# EAGLE design Payload-Camera (EAGLE 9.5.1)
DESIGNER: Hendrik Melse; PART_NUMBER: 68-0007; PROJECT: CougSat-1: Camera; REV: 1.1.2

## Sheet 1 of 6
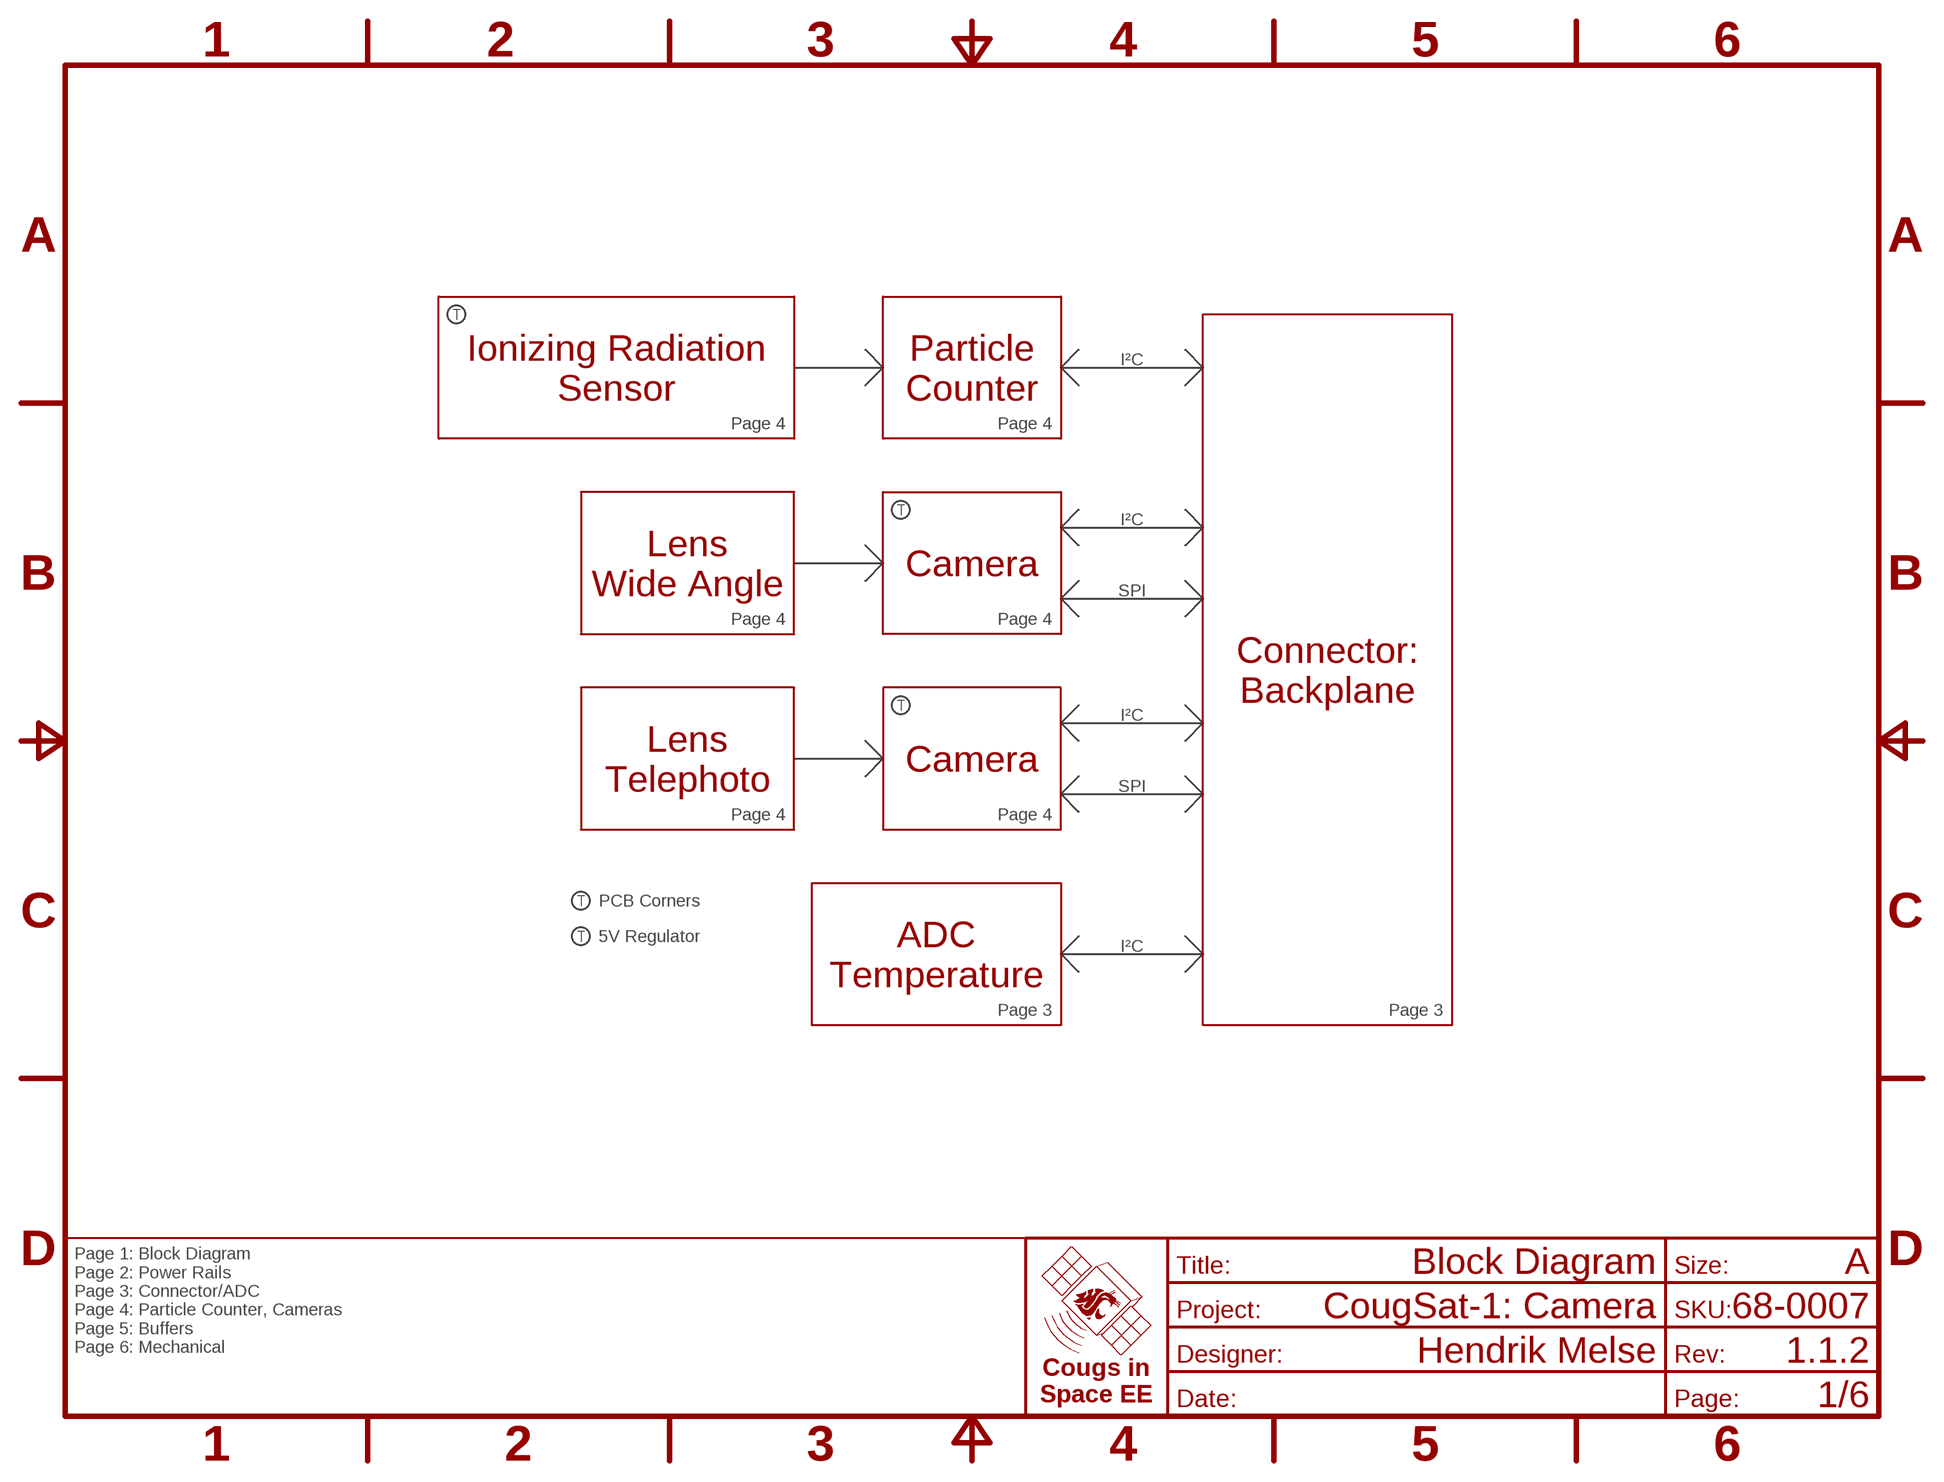
[diagram p0: schematic, sheet 1]
FRAME1 (FRAME-A): TITLE: Block Diagram

### Notes on the sheet
- I²C
- Ionizing Radiation
  Sensor
- Particle
  Counter
- Page 4 | Page 4
- I²C
- Lens
  Wide Angle
- Camera
- SPI
- Page 4 | Page 4
- Connector:
  Backplane
- I²C
- Lens
  Telephoto
- Camera
- SPI
- Page 4 | Page 4
- PCB Corners
- 5V Regulator
- I²C
- ADC
  Temperature
- Page 3 | Page 3
- Page 1: Block Diagram
  Page 2: Power Rails
  Page 3: Connector/ADC
  Page 4: Particle Counter, Cameras
  Page 5: Buffers
  Page 6: Mechanical

## Sheet 2 of 6
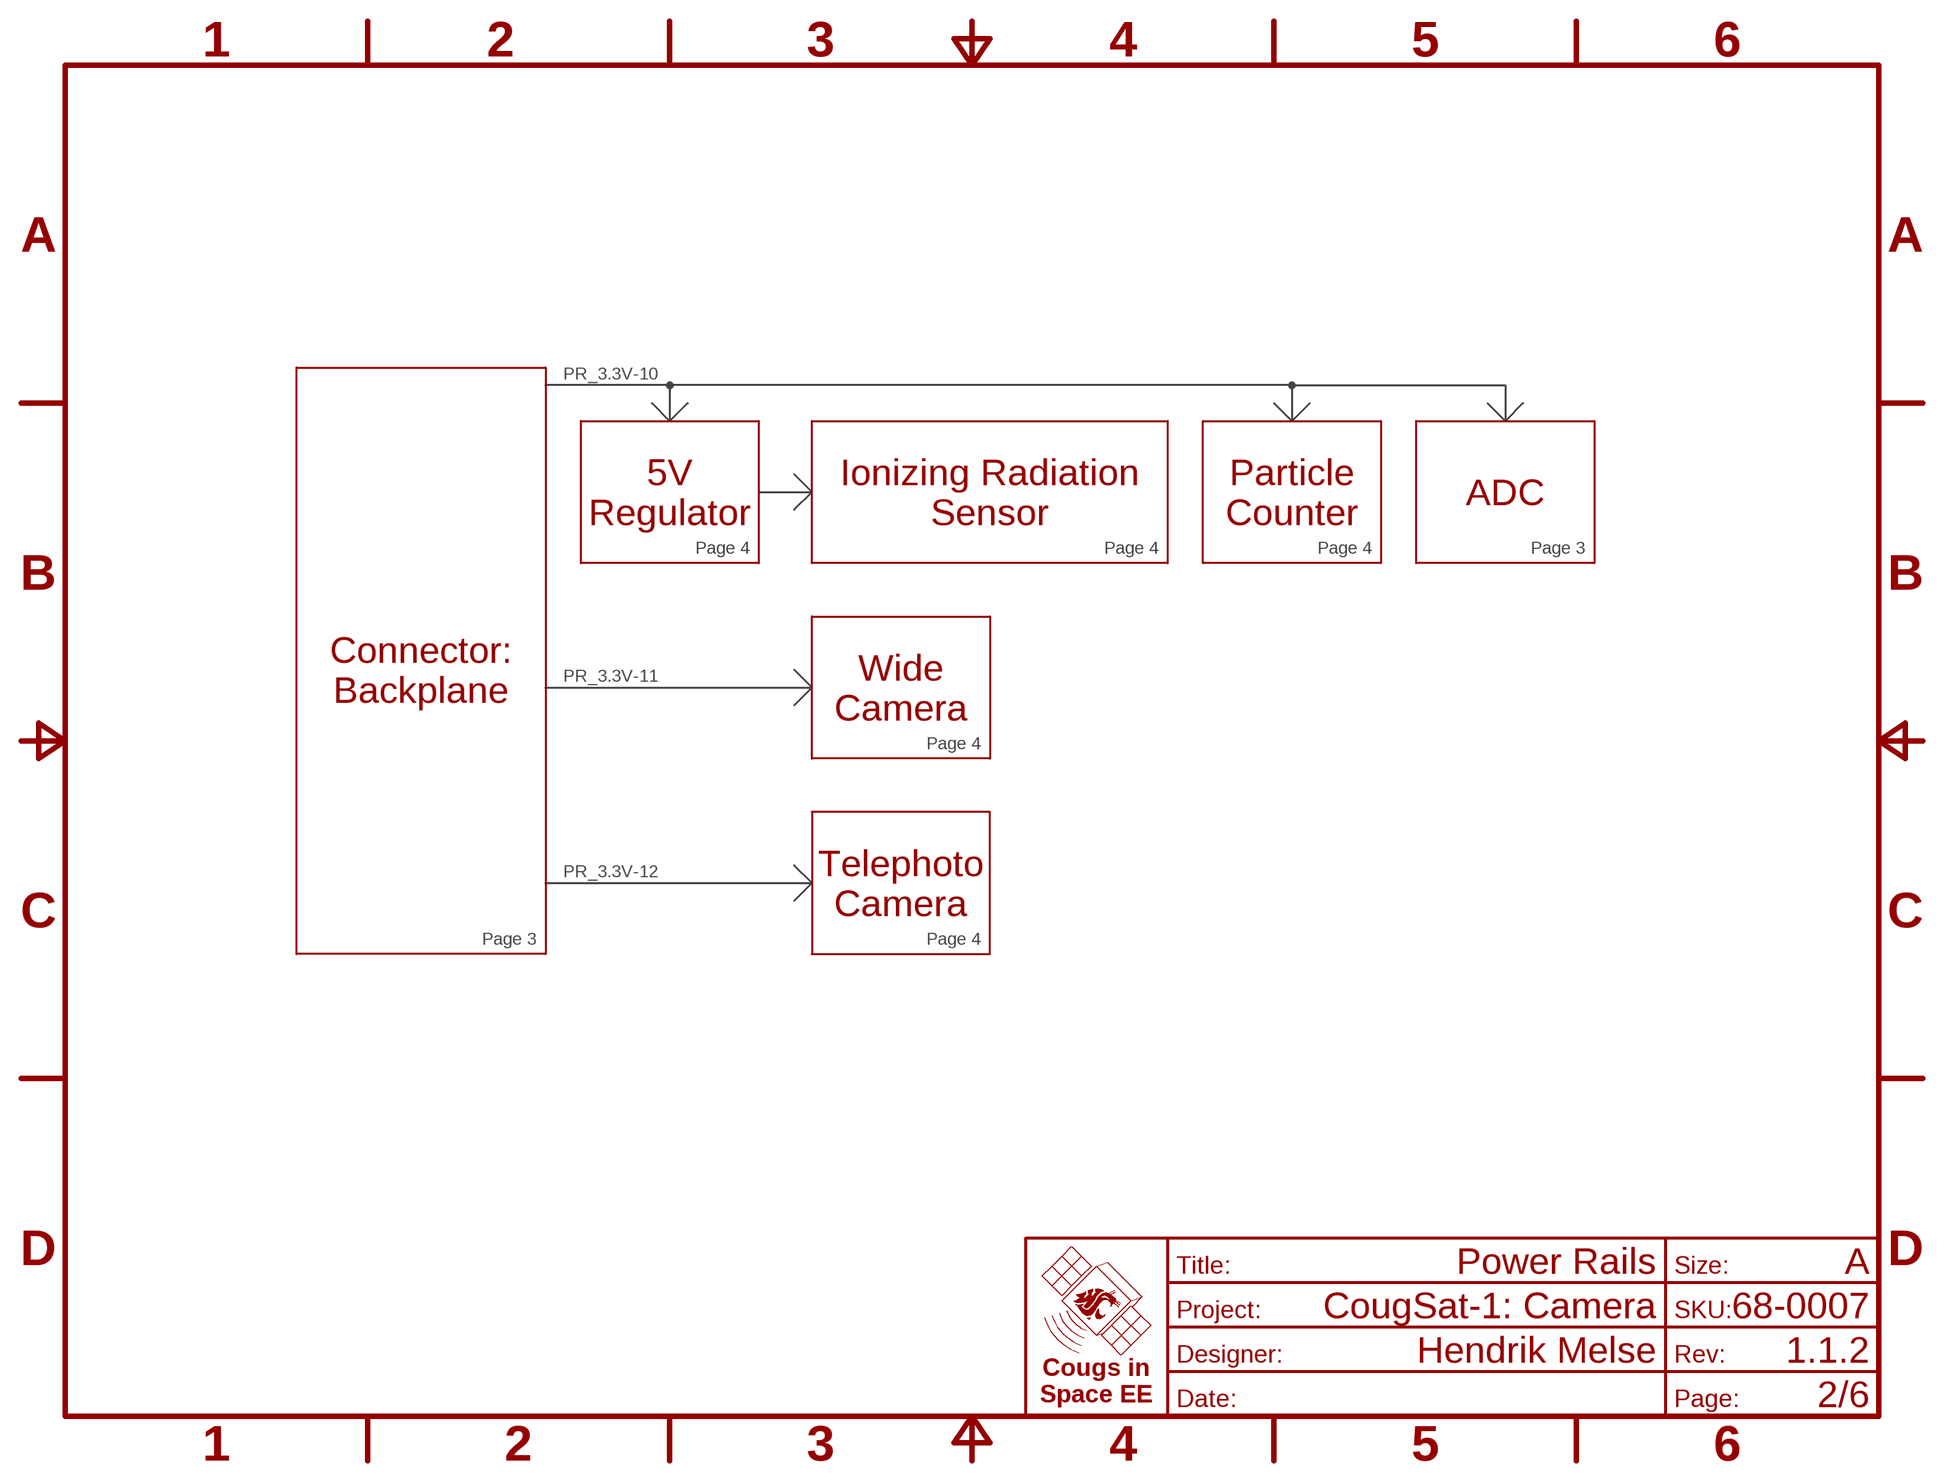
[diagram p1: schematic, sheet 2]
FRAME2 (FRAME-A): TITLE: Power Rails

### Notes on the sheet
- PR_3.3V-10
- 5V
  Regulator
- Ionizing Radiation
  Sensor
- Particle
  Counter
- ADC
- Page 4 | Page 4 | Page 4 | Page 3
- Connector:
  Backplane
- PR_3.3V-11
- Wide
  Camera
- Page 4
- PR_3.3V-12
- Telephoto
  Camera
- Page 3 | Page 4

## Sheet 3 of 6
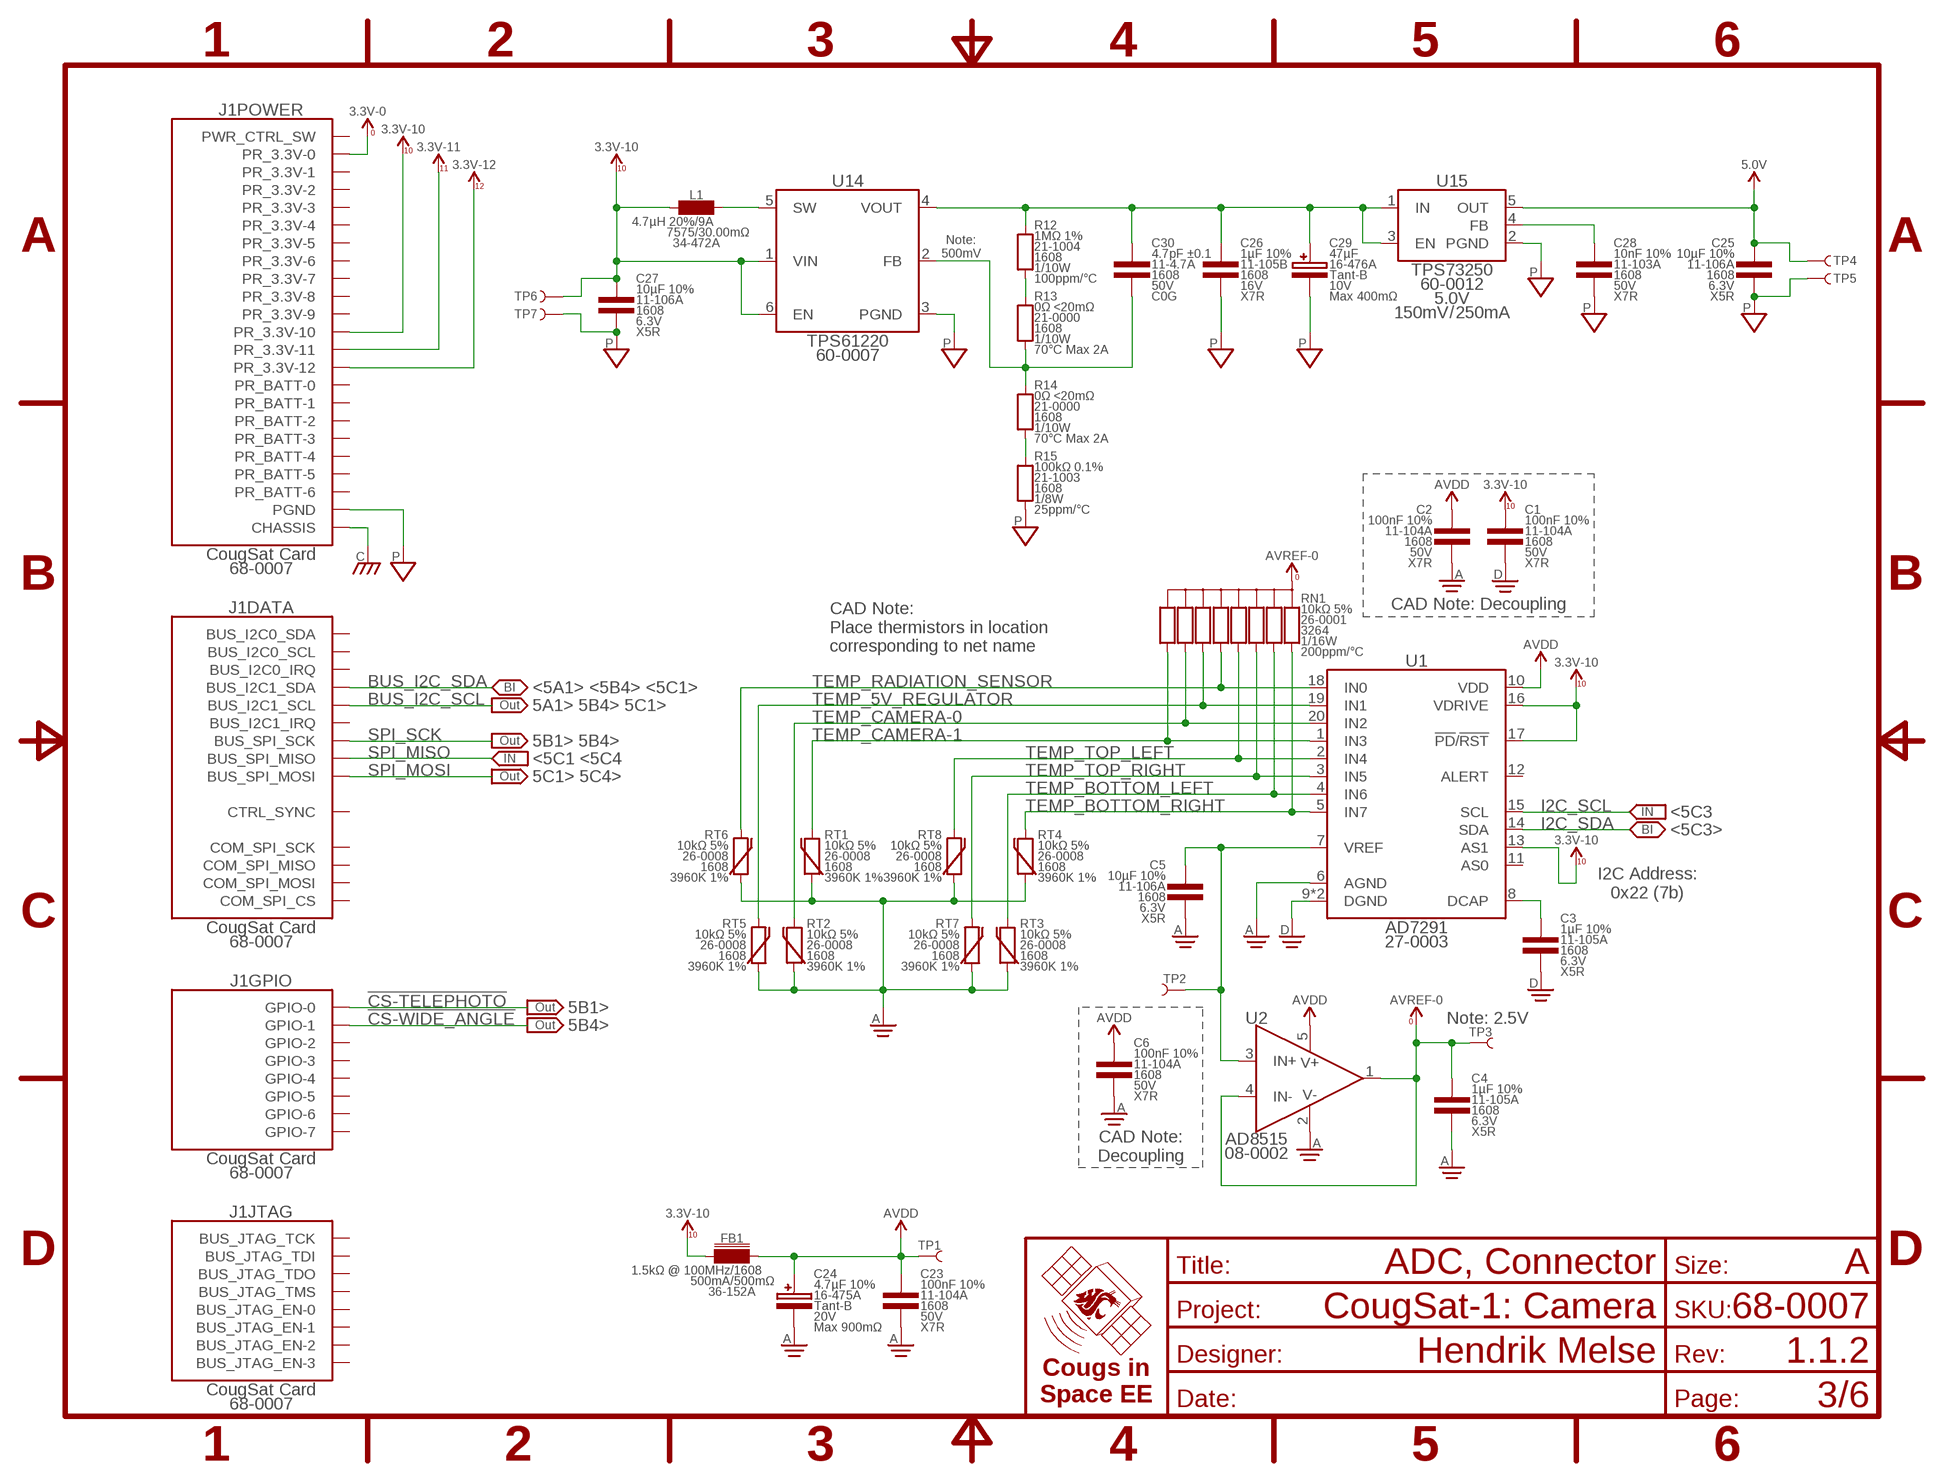
[diagram p2: schematic, sheet 3]
FRAME3 (FRAME-A): TITLE: ADC, Connector

### Parts
C1  100nF 10%  CAP-V-100NF-1608  [1608]
C2  100nF 10%  CAP-V-100NF-1608  [1608]
C3  1µF 10%  CAP-V-1UF-1608  [1608]
C4  1µF 10%  CAP-V-1UF-1608  [1608]
C5  10µF 10%  CAP-V-10UF-1608  [1608]
C6  100nF 10%  CAP-V-100NF-1608  [1608]
C23  100nF 10%  CAP-V-100NF-1608  [1608]
C24  4.7µF 10%  CAP-POL-V-4.7UF-4028  [4028-POL]
C25  10µF 10%  CAP-V-10UF-1608  [1608]
C26  1µF 10%  CAP-V-1UF-B-1608  [1608]
C27  10µF 10%  CAP-V-10UF-1608  [1608]
C28  10nF 10%  CAP-V-10NF-1608  [1608]
C29  47µF  CAP-POL-V-47UF-4028  [4028-POL]
C30  4.7pF ±0.1  CAP-V-4.7PF-1608  [1608]
FB1  1.5kΩ @ 100MHz  CHOKE-H-1.5K-1608  [1608]
J1  CougSat Card  CIS_CARD-OPEN+X  [CARD-FULL-OPEN+X]
L1  4.7µH 20%  INDUCTOR-H-4.7UH-7575  [7575]
R12  1MΩ 1%  RES-V-1M-1608  [1608]
R13  0Ω <20mΩ  RES-V-0-1608  [1608]
R14  0Ω <20mΩ  RES-V-0-1608  [1608]
R15  100kΩ 0.1%  RES-V-100K-1608  [1608]
RN1  10kΩ 5%  RES_BUS-10-10K-3264  [3264]
RT1  10kΩ 5%  THERMISTOR-V-10K-1608  [1608]
RT2  10kΩ 5%  THERMISTOR-V-10K-1608  [1608]
RT3  10kΩ 5%  THERMISTOR-V-10K-1608  [1608]
RT4  10kΩ 5%  THERMISTOR-V-10K-1608  [1608]
RT5  10kΩ 5%  THERMISTOR-V-10K-1608  [1608]
RT6  10kΩ 5%  THERMISTOR-V-10K-1608  [1608]
RT7  10kΩ 5%  THERMISTOR-V-10K-1608  [1608]
RT8  10kΩ 5%  THERMISTOR-V-10K-1608  [1608]
TP1  TEST_POINT-SMD-C-1.25  [SMD-C-1.25]
TP2  TEST_POINT-SMD-C-1.25  [SMD-C-1.25]
TP3  TEST_POINT-SMD-C-1.25  [SMD-C-1.25]
TP4  TEST_POINT-THT-1.0  [THT-1.0]
TP5  TEST_POINT-THT-1.0  [THT-1.0]
TP6  TEST_POINT-THT-1.0  [THT-1.0]
TP7  TEST_POINT-THT-1.0  [THT-1.0]
U1  AD7291  [QFN-20-4040]
U2  AD8515  OPAMP-1-AD8515  [SOT23-5]
U14  TPS61220  [SOT363]
U15  TPS73250  LDO-FB-5.0-SOT23-5  [SOT23-5]

### Nets
3.3V_0: J1.A1(POWER:PR_3.3V-0) J1.B1(POWER:PR_3.3V-0) ; supply symbol labelled 3.3V-0 ; also sheet 5
3.3V_10: C1.1 C27.1 FB1.1 J1.A11(POWER:PR_3.3V-10) J1.B11(POWER:PR_3.3V-10) L1.1 TP6.1 U1.13(AS1) U1.16(VDRIVE) U1.17(!PD!/!RST) U14.1(VIN) U14.6(EN) ; supply symbol labelled 3.3V-10 ; also sheet 4,5
3.3V_11: J1.A12(POWER:PR_3.3V-11) J1.B12(POWER:PR_3.3V-11) ; supply symbol labelled 3.3V-11 ; also sheet 4,5
3.3V_12: J1.A13(POWER:PR_3.3V-12) J1.B13(POWER:PR_3.3V-12) ; supply symbol labelled 3.3V-12 ; also sheet 4,5
5.0V: C25.1 TP4.1 U15.5(OUT) ; also sheet 4
!CS-TELEPHOTO: J1.A24(GPIO:GPIO-0) ; also sheet 5
!CS-WIDE_ANGLE: J1.A25(GPIO:GPIO-1) ; also sheet 5
ADC_DCAP: C3.1 U1.8(DCAP)
ADC_VREF: C5.1 TP2.1 U1.7(VREF) U2.3(IN+)
AGND: C2.2 C4.2 C5.2 C6.2 C23.2 C24.C RT1.1 RT2.1 RT3.1 RT4.1 RT5.1 RT6.1 RT7.1 RT8.1 U1.6(AGND) U2.2(V-) ; also sheet 4,6
AVDD: C2.1 C6.1 C23.1 C24.A FB1.2 TP1.1 U1.10(VDD) U2.5(V+)
AVREF-0: C4.1 RN1.5(C) RN1.10(C) TP3.1 U2.1(OUT) U2.4(IN-)
BOOST_FB: C30.2 R13.1 R14.2 U14.2(FB)
BOOST_FB-HIGH: R12.1 R13.2
BOOST_FB-LOW: R14.1 R15.2
BOOST_IN: L1.2 U14.5(SW)
BOOST_OUT: C26.1 C29.A C30.1 R12.2 U14.4(VOUT) U15.1(IN) U15.3(EN)
BUS_I2C_SCL: J1.A31(DATA:BUS_I2C1_SCL) J1.B31(DATA:BUS_I2C1_SCL) ; also sheet 5
BUS_I2C_SDA: J1.A30(DATA:BUS_I2C1_SDA) J1.B30(DATA:BUS_I2C1_SDA) ; also sheet 5
CHASSIS: J1.CHASSIS@1(POWER:CHASSIS) J1.CHASSIS@2(POWER:CHASSIS) J1.CHASSIS@3(POWER:CHASSIS) J1.CHASSIS@4(POWER:CHASSIS) ; also sheet 4
DGND: C1.2 C3.2 U1.9(DGND) U1.PAD(DGND) ; also sheet 4,5
I2C_SCL: U1.15(SCL) ; also sheet 4,5
I2C_SDA: U1.14(SDA) ; also sheet 4,5
PGND: C25.2 C26.2 C27.2 C28.2 C29.C J1.A21(POWER:PGND) J1.A22(POWER:PGND) J1.A23(POWER:PGND) J1.B21(POWER:PGND) J1.B22(POWER:PGND) J1.B23(POWER:PGND) J1.B24(POWER:PGND) J1.B25(POWER:PGND) J1.B26(POWER:PGND) J1.B27(POWER:PGND) J1.B28(POWER:PGND) J1.B29(POWER:PGND) R15.1 TP5.1 TP7.1 U14.3(PGND) U15.2(PGND) ; also sheet 4
REG_FB: C28.1 U15.4(FB)
SPI_MISO: J1.A38(DATA:BUS_SPI_MISO) J1.B38(DATA:BUS_SPI_MISO) ; also sheet 5
SPI_MOSI: J1.A39(DATA:BUS_SPI_MOSI) J1.B39(DATA:BUS_SPI_MOSI) ; also sheet 5
SPI_SCK: J1.A37(DATA:BUS_SPI_SCK) J1.B37(DATA:BUS_SPI_SCK) ; also sheet 5
TEMP_5V_REGULATOR: RN1.7 RT5.2 U1.19(IN1)
TEMP_BOTTOM_LEFT: RN1.2 RT3.2 U1.4(IN6)
TEMP_BOTTOM_RIGHT: RN1.1 RT4.2 U1.5(IN7)
TEMP_CAMERA-0: RN1.8 RT2.2 U1.20(IN2)
TEMP_CAMERA-1: RN1.9 RT1.2 U1.1(IN3)
TEMP_RADIATION_SENSOR: RN1.6 RT6.2 U1.18(IN0)
TEMP_TOP_LEFT: RN1.4 RT8.2 U1.2(IN4)
TEMP_TOP_RIGHT: RN1.3 RT7.2 U1.3(IN5)
Unconnected: J1.A26(GPIO:GPIO-2) J1.A27(GPIO:GPIO-3) J1.A28(GPIO:GPIO-4) J1.A29(GPIO:GPIO-5) J1.A32(DATA:BUS_I2C1_IRQ) J1.A33(DATA:COM_SPI_SCK) J1.A34(DATA:COM_SPI_MISO) J1.A35(DATA:COM_SPI_MOSI) J1.A36(DATA:COM_SPI_CS) J1.A40(POWER:PWR_CTRL_SW) J1.A41(GPIO:GPIO-6) J1.A42(DATA:CTRL_SYNC) J1.A43(DATA:BUS_I2C0_SDA) J1.A44(DATA:BUS_I2C0_SCL) J1.A45(DATA:BUS_I2C0_IRQ) J1.A46(JTAG:BUS_JTAG_TCK) J1.A47(JTAG:BUS_JTAG_TDI) J1.A48(JTAG:BUS_JTAG_TDO) J1.A49(JTAG:BUS_JTAG_TMS) J1.B32(DATA:BUS_I2C1_IRQ) J1.B33(DATA:COM_SPI_SCK) J1.B34(DATA:COM_SPI_MISO) J1.B35(DATA:COM_SPI_MOSI) J1.B36(DATA:COM_SPI_CS) J1.B40(POWER:PWR_CTRL_SW) J1.B41(GPIO:GPIO-7) J1.B42(DATA:CTRL_SYNC) J1.B43(DATA:BUS_I2C0_SDA) J1.B44(DATA:BUS_I2C0_SCL) J1.B45(DATA:BUS_I2C0_IRQ) J1.B46(JTAG:BUS_JTAG_EN-0) J1.B47(JTAG:BUS_JTAG_EN-1) J1.B48(JTAG:BUS_JTAG_EN-2) J1.B49(JTAG:BUS_JTAG_EN-3) U1.11(AS0) U1.12(ALERT)

### Notes on the sheet
- Note:
  500mV
- CAD Note: Decoupling
- CAD Note:
  Place thermistors in location
  corresponding to net name
- <5A1> <5B4> <5C1>
- 5A1> 5B4> 5C1>
- 5B1> 5B4>
- <5C1 <5C4
- 5C1> 5C4>
- <5C3
- <5C3>
- I2C Address:
  0x22 (7b)
- 5B1>
- Note: 2.5V
- 5B4>
- CAD Note:
  Decoupling

## Sheet 4 of 6
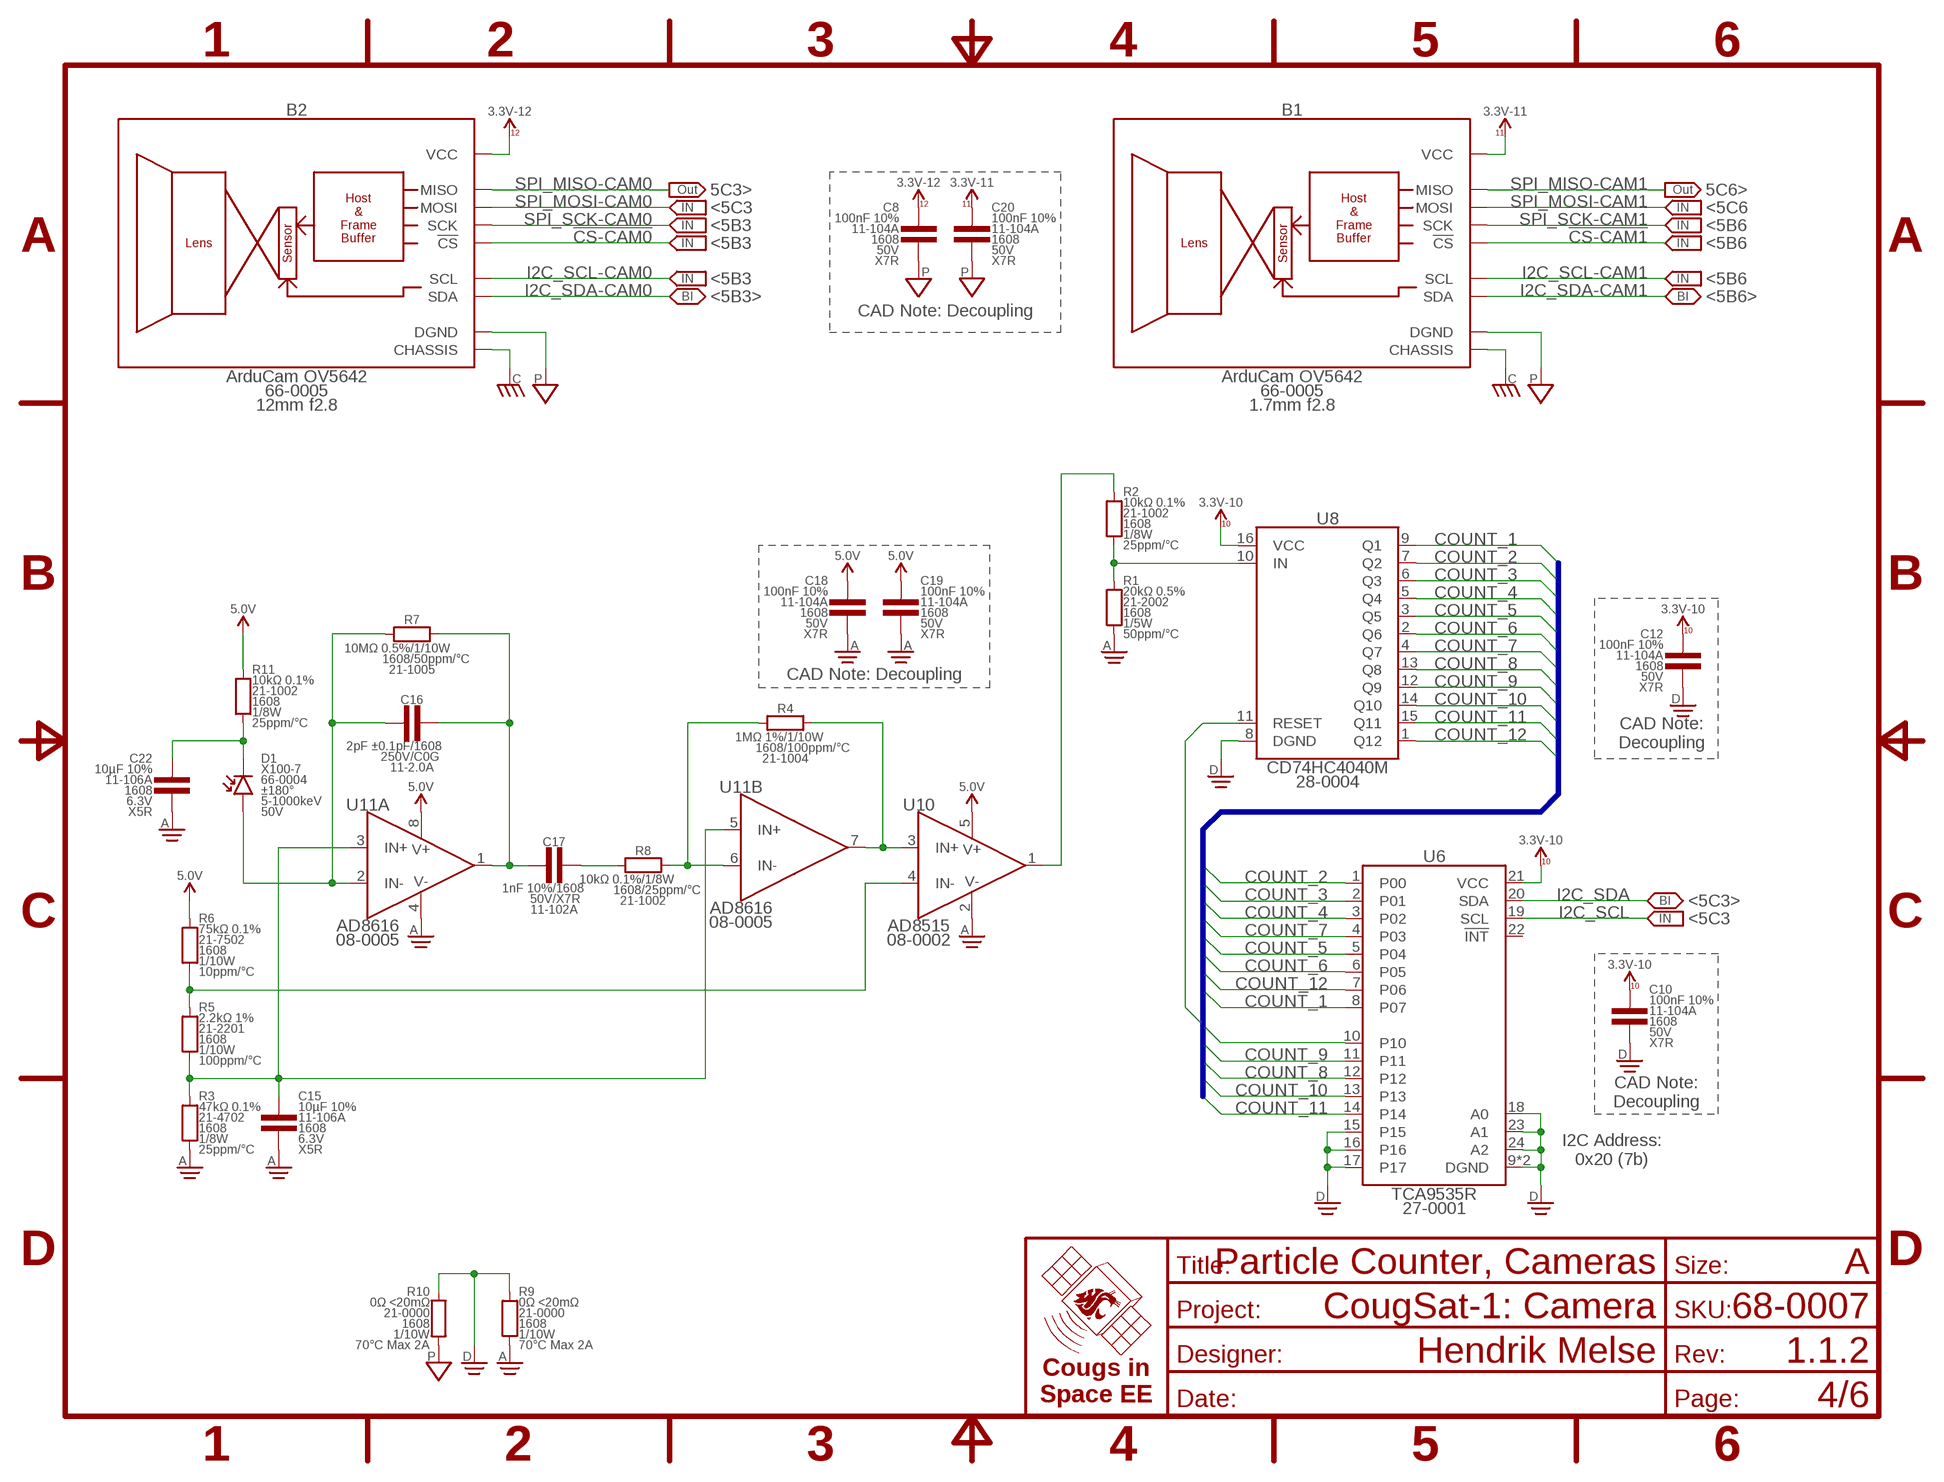
[diagram p3: schematic, sheet 4]
FRAME5 (FRAME-A): TITLE: Particle Counter, Cameras

### Parts
B1  ArduCam OV5642  ARDUCAM-5MP-1.7MM-F2.8  [ARDUCAM]
B2  ArduCam OV5642  ARDUCAM-5MP-12MM-F2.8  [ARDUCAM]
C8  100nF 10%  CAP-V-100NF-1608  [1608]
C10  100nF 10%  CAP-V-100NF-1608  [1608]
C12  100nF 10%  CAP-V-100NF-1608  [1608]
C15  10µF 10%  CAP-V-10UF-1608  [1608]
C16  2pF ±0.1pF  CAP-H-2PF-1608  [1608]
C17  1nF 10%  CAP-H-1NF-1608  [1608]
C18  100nF 10%  CAP-V-100NF-1608  [1608]
C19  100nF 10%  CAP-V-100NF-1608  [1608]
C20  100nF 10%  CAP-V-100NF-1608  [1608]
C22  10µF 10%  CAP-V-10UF-1608  [1608]
D1  X100-7  PHOTODIODE-X100-7-THD  [X100-7-THD]
R1  20kΩ 0.5%  RES-V-20K-1608  [1608]
R2  10kΩ 0.1%  RES-V-10K-1608  [1608]
R3  47kΩ 0.1%  RES-V-47K-1608  [1608]
R4  1MΩ 1%  RES-H-1M-1608  [1608]
R5  2.2kΩ 1%  RES-V-2.2K-1608  [1608]
R6  75kΩ 0.1%  RES-V-75K-1608  [1608]
R7  10MΩ 0.5%  RES-H-10M-1608  [1608]
R8  10kΩ 0.1%  RES-H-10K-1608  [1608]
R9  0Ω <20mΩ  RES-V-0-1608  [1608]
R10  0Ω <20mΩ  RES-V-0-1608  [1608]
R11  10kΩ 0.1%  RES-V-10K-1608  [1608]
U6  TCA9535R  [QFN-24-4040]
U8  CD74HC4040M  COUNTER_BINARY-12BITSO16  [SO16]
U10  AD8515  OPAMP-1-AD8515  [SOT23-5]
U11  AD8616  OPAMP-2-AD8616-MSOP8  [MSOP-8]

### Nets
3.3V_10: C10.1 C12.1 U6.21(VCC) U8.16(VCC) ; supply symbol labelled 3.3V-10 ; also sheet 3,5
3.3V_11: B1.6(VCC) C20.1 ; supply symbol labelled 3.3V-11 ; also sheet 3,5
3.3V_12: B2.6(VCC) C8.1 ; supply symbol labelled 3.3V-12 ; also sheet 3,5
5.0V: C18.1 C19.1 R6.2 R11.2 U10.5(V+) U11.8(A:V+) ; also sheet 3
!CS-CAM0: B2.1(!CS) ; also sheet 5
!CS-CAM1: B1.1(!CS) ; also sheet 5
AGND: C15.2 C18.2 C19.2 C22.2 R1.1 R3.1 R9.1 U10.2(V-) U11.4(A:V-) ; also sheet 3,6
ATRIP: R2.2 U10.1(OUT)
CHASSIS: B1.CHASSIS@1(CHASSIS) B1.CHASSIS@2(CHASSIS) B1.CHASSIS@3(CHASSIS) B1.CHASSIS@4(CHASSIS) B1.CHASSIS@5(CHASSIS) B1.CHASSIS@6(CHASSIS) B1.CHASSIS@7(CHASSIS) B1.CHASSIS@8(CHASSIS) B1.CHASSIS@9(CHASSIS) B1.CHASSIS@10(CHASSIS) B1.CHASSIS@11(CHASSIS) B1.CHASSIS@12(CHASSIS) B1.CHASSIS@13(CHASSIS) B1.CHASSIS@14(CHASSIS) B1.CHASSIS@15(CHASSIS) B1.CHASSIS@16(CHASSIS) B1.CHASSIS@17(CHASSIS) B1.CHASSIS@18(CHASSIS) B2.CHASSIS@1(CHASSIS) B2.CHASSIS@2(CHASSIS) B2.CHASSIS@3(CHASSIS) B2.CHASSIS@4(CHASSIS) B2.CHASSIS@5(CHASSIS) B2.CHASSIS@6(CHASSIS) B2.CHASSIS@7(CHASSIS) B2.CHASSIS@8(CHASSIS) B2.CHASSIS@9(CHASSIS) B2.CHASSIS@10(CHASSIS) B2.CHASSIS@11(CHASSIS) B2.CHASSIS@12(CHASSIS) B2.CHASSIS@13(CHASSIS) B2.CHASSIS@14(CHASSIS) B2.CHASSIS@15(CHASSIS) B2.CHASSIS@16(CHASSIS) B2.CHASSIS@17(CHASSIS) B2.CHASSIS@18(CHASSIS) ; also sheet 3
COUNT_1: U6.8(P07) U8.9(Q1)
COUNT_2: U6.1(P00) U8.7(Q2)
COUNT_3: U6.2(P01) U8.6(Q3)
COUNT_4: U6.3(P02) U8.5(Q4)
COUNT_5: U6.5(P04) U8.3(Q5)
COUNT_6: U6.6(P05) U8.2(Q6)
COUNT_7: U6.4(P03) U8.4(Q7)
COUNT_8: U6.12 U8.13(Q8)
COUNT_9: U6.11 U8.12(Q9)
COUNT_10: U6.13 U8.14(Q10)
COUNT_11: U6.14 U8.15(Q11)
COUNT_12: U6.7(P06) U8.1(Q12)
COUNTER_IN: R1.2 R2.1 U8.10(IN)
COUNTER_RESET: U6.10 U8.11(RESET)
DGND: C10.2 C12.2 R9.2 R10.2 U6.9(DGND) U6.15 U6.16 U6.17 U6.18(A0) U6.23(A1) U6.24(A2) U6.PAD(DGND) U8.8(DGND) ; also sheet 3,5
DIFF_IN: R4.1 R8.2 U11.6(B:IN-)
DIFF_INT_IN: C17.2 R8.1
DIFF_OUT: R4.2 U10.3(IN+) U11.7(B:OUT)
I2C_SCL: U6.19(SCL) ; also sheet 3,5
I2C_SCL-CAM0: B2.8(SCL) ; also sheet 5
I2C_SCL-CAM1: B1.8(SCL) ; also sheet 5
I2C_SDA: U6.20(SDA) ; also sheet 3,5
I2C_SDA-CAM0: B2.7(SDA) ; also sheet 5
I2C_SDA-CAM1: B1.7(SDA) ; also sheet 5
PD_IN: C22.1 D1.C R11.1
PD_OUT_THRESH: R5.2 R6.1 U10.4(IN-)
PD_VDIV_OUT: C15.1 R3.2 R5.1 U11.3(A:IN+) U11.5(B:IN+)
PGND: B1.5(DGND) B2.5(DGND) C8.2 C20.2 R10.1 ; also sheet 3
QAMP_IN: C16.1 D1.A R7.1 U11.2(A:IN-)
QAMP_OUT: C16.2 C17.1 R7.2 U11.1(A:OUT)
SPI_MISO-CAM0: B2.3(MISO) ; also sheet 5
SPI_MISO-CAM1: B1.3(MISO) ; also sheet 5
SPI_MOSI-CAM0: B2.2(MOSI) ; also sheet 5
SPI_MOSI-CAM1: B1.2(MOSI) ; also sheet 5
SPI_SCK-CAM0: B2.4(SCK) ; also sheet 5
SPI_SCK-CAM1: B1.4(SCK) ; also sheet 5
Unconnected: U6.22(!INT)

### Buses
COUNT_1,COUNT_2,COUNT_3,COUNT_4,COUNT_5,COUNT_6,COUNT_7,COUNT_8,COUNT_9,COUNT_10,COUNT_11,COUNT_12

### Notes on the sheet
- 5C3> | 5C6>
- <5C3 | <5C6
- <5B3 | <5B6
- <5B3 | <5B6
- <5B3 | <5B6
- <5B3> | <5B6>
- CAD Note: Decoupling
- CAD Note: Decoupling
- CAD Note:
  Decoupling
- <5C3>
- <5C3
- CAD Note:
  Decoupling
- I2C Address:
  0x20 (7b)

## Sheet 5 of 6
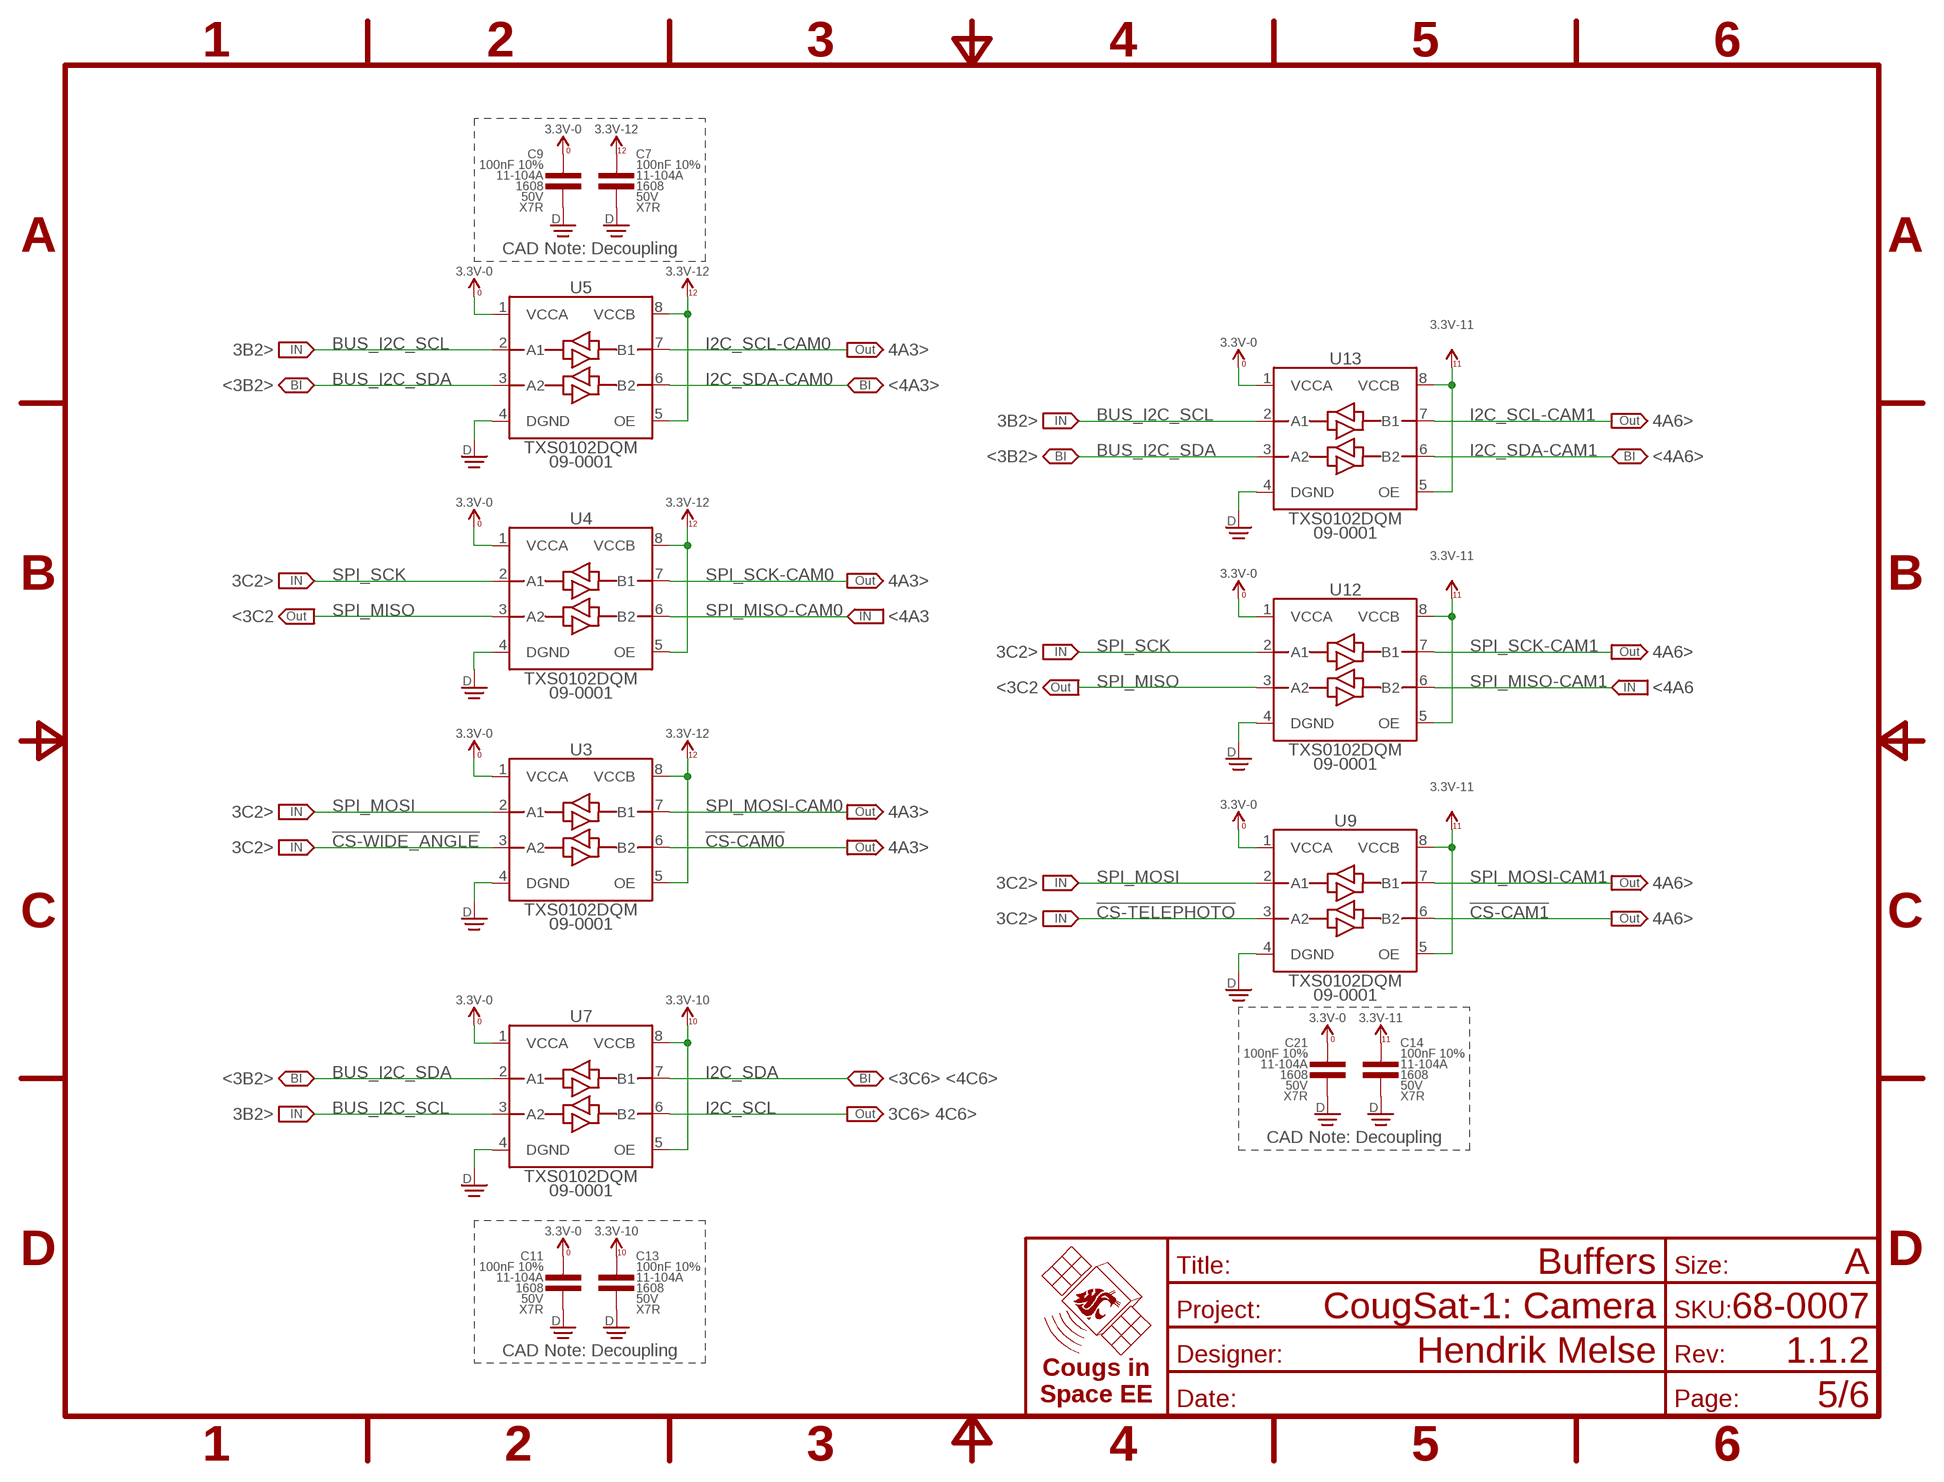
[diagram p4: schematic, sheet 5]
FRAME6 (FRAME-A): TITLE: Buffers

### Parts
C7  100nF 10%  CAP-V-100NF-1608  [1608]
C9  100nF 10%  CAP-V-100NF-1608  [1608]
C11  100nF 10%  CAP-V-100NF-1608  [1608]
C13  100nF 10%  CAP-V-100NF-1608  [1608]
C14  100nF 10%  CAP-V-100NF-1608  [1608]
C21  100nF 10%  CAP-V-100NF-1608  [1608]
U3  TXS0102DQM  LEVEL_SHIFTER-2BIT-XSON-8  [X2SON-8]
U4  TXS0102DQM  LEVEL_SHIFTER-2BIT-XSON-8  [X2SON-8]
U5  TXS0102DQM  LEVEL_SHIFTER-2BIT-XSON-8  [X2SON-8]
U7  TXS0102DQM  LEVEL_SHIFTER-2BIT-XSON-8  [X2SON-8]
U9  TXS0102DQM  LEVEL_SHIFTER-2BIT-XSON-8  [X2SON-8]
U12  TXS0102DQM  LEVEL_SHIFTER-2BIT-XSON-8  [X2SON-8]
U13  TXS0102DQM  LEVEL_SHIFTER-2BIT-XSON-8  [X2SON-8]

### Nets
3.3V_0: C9.1 C11.1 C21.1 U3.1(VCCA) U4.1(VCCA) U5.1(VCCA) U7.1(VCCA) U9.1(VCCA) U12.1(VCCA) U13.1(VCCA) ; supply symbol labelled 3.3V-0 ; also sheet 3
3.3V_10: C13.1 U7.5(OE) U7.8(VCCB) ; supply symbol labelled 3.3V-10 ; also sheet 3,4
3.3V_11: C14.1 U9.5(OE) U9.8(VCCB) U12.5(OE) U12.8(VCCB) U13.5(OE) U13.8(VCCB) ; supply symbol labelled 3.3V-11 ; also sheet 3,4
3.3V_12: C7.1 U3.5(OE) U3.8(VCCB) U4.5(OE) U4.8(VCCB) U5.5(OE) U5.8(VCCB) ; supply symbol labelled 3.3V-12 ; also sheet 3,4
!CS-CAM0: U3.6(B2) ; also sheet 4
!CS-CAM1: U9.6(B2) ; also sheet 4
!CS-TELEPHOTO: U9.3(A2) ; also sheet 3
!CS-WIDE_ANGLE: U3.3(A2) ; also sheet 3
BUS_I2C_SCL: U5.2(A1) U7.3(A2) U13.2(A1) ; also sheet 3
BUS_I2C_SDA: U5.3(A2) U7.2(A1) U13.3(A2) ; also sheet 3
DGND: C7.2 C9.2 C11.2 C13.2 C14.2 C21.2 U3.4(DGND) U4.4(DGND) U5.4(DGND) U7.4(DGND) U9.4(DGND) U12.4(DGND) U13.4(DGND) ; also sheet 3,4
I2C_SCL: U7.6(B2) ; also sheet 3,4
I2C_SCL-CAM0: U5.7(B1) ; also sheet 4
I2C_SCL-CAM1: U13.7(B1) ; also sheet 4
I2C_SDA: U7.7(B1) ; also sheet 3,4
I2C_SDA-CAM0: U5.6(B2) ; also sheet 4
I2C_SDA-CAM1: U13.6(B2) ; also sheet 4
SPI_MISO: U4.3(A2) U12.3(A2) ; also sheet 3
SPI_MISO-CAM0: U4.6(B2) ; also sheet 4
SPI_MISO-CAM1: U12.6(B2) ; also sheet 4
SPI_MOSI: U3.2(A1) U9.2(A1) ; also sheet 3
SPI_MOSI-CAM0: U3.7(B1) ; also sheet 4
SPI_MOSI-CAM1: U9.7(B1) ; also sheet 4
SPI_SCK: U4.2(A1) U12.2(A1) ; also sheet 3
SPI_SCK-CAM0: U4.7(B1) ; also sheet 4
SPI_SCK-CAM1: U12.7(B1) ; also sheet 4

### Notes on the sheet
- CAD Note: Decoupling
- 3B2> | 4A3>
- <3B2> | <4A3>
- 3B2> | 4A6>
- <3B2> | <4A6>
- 3C2> | 4A3>
- <3C2 | <4A3
- 3C2> | 4A6>
- <3C2 | <4A6
- 3C2> | 4A3>
- 3C2> | 4A3>
- 3C2> | 4A6>
- 3C2> | 4A6>
- <3B2> | <3C6> <4C6>
- 3B2> | 3C6> 4C6>
- CAD Note: Decoupling
- CAD Note: Decoupling

## Sheet 6 of 6
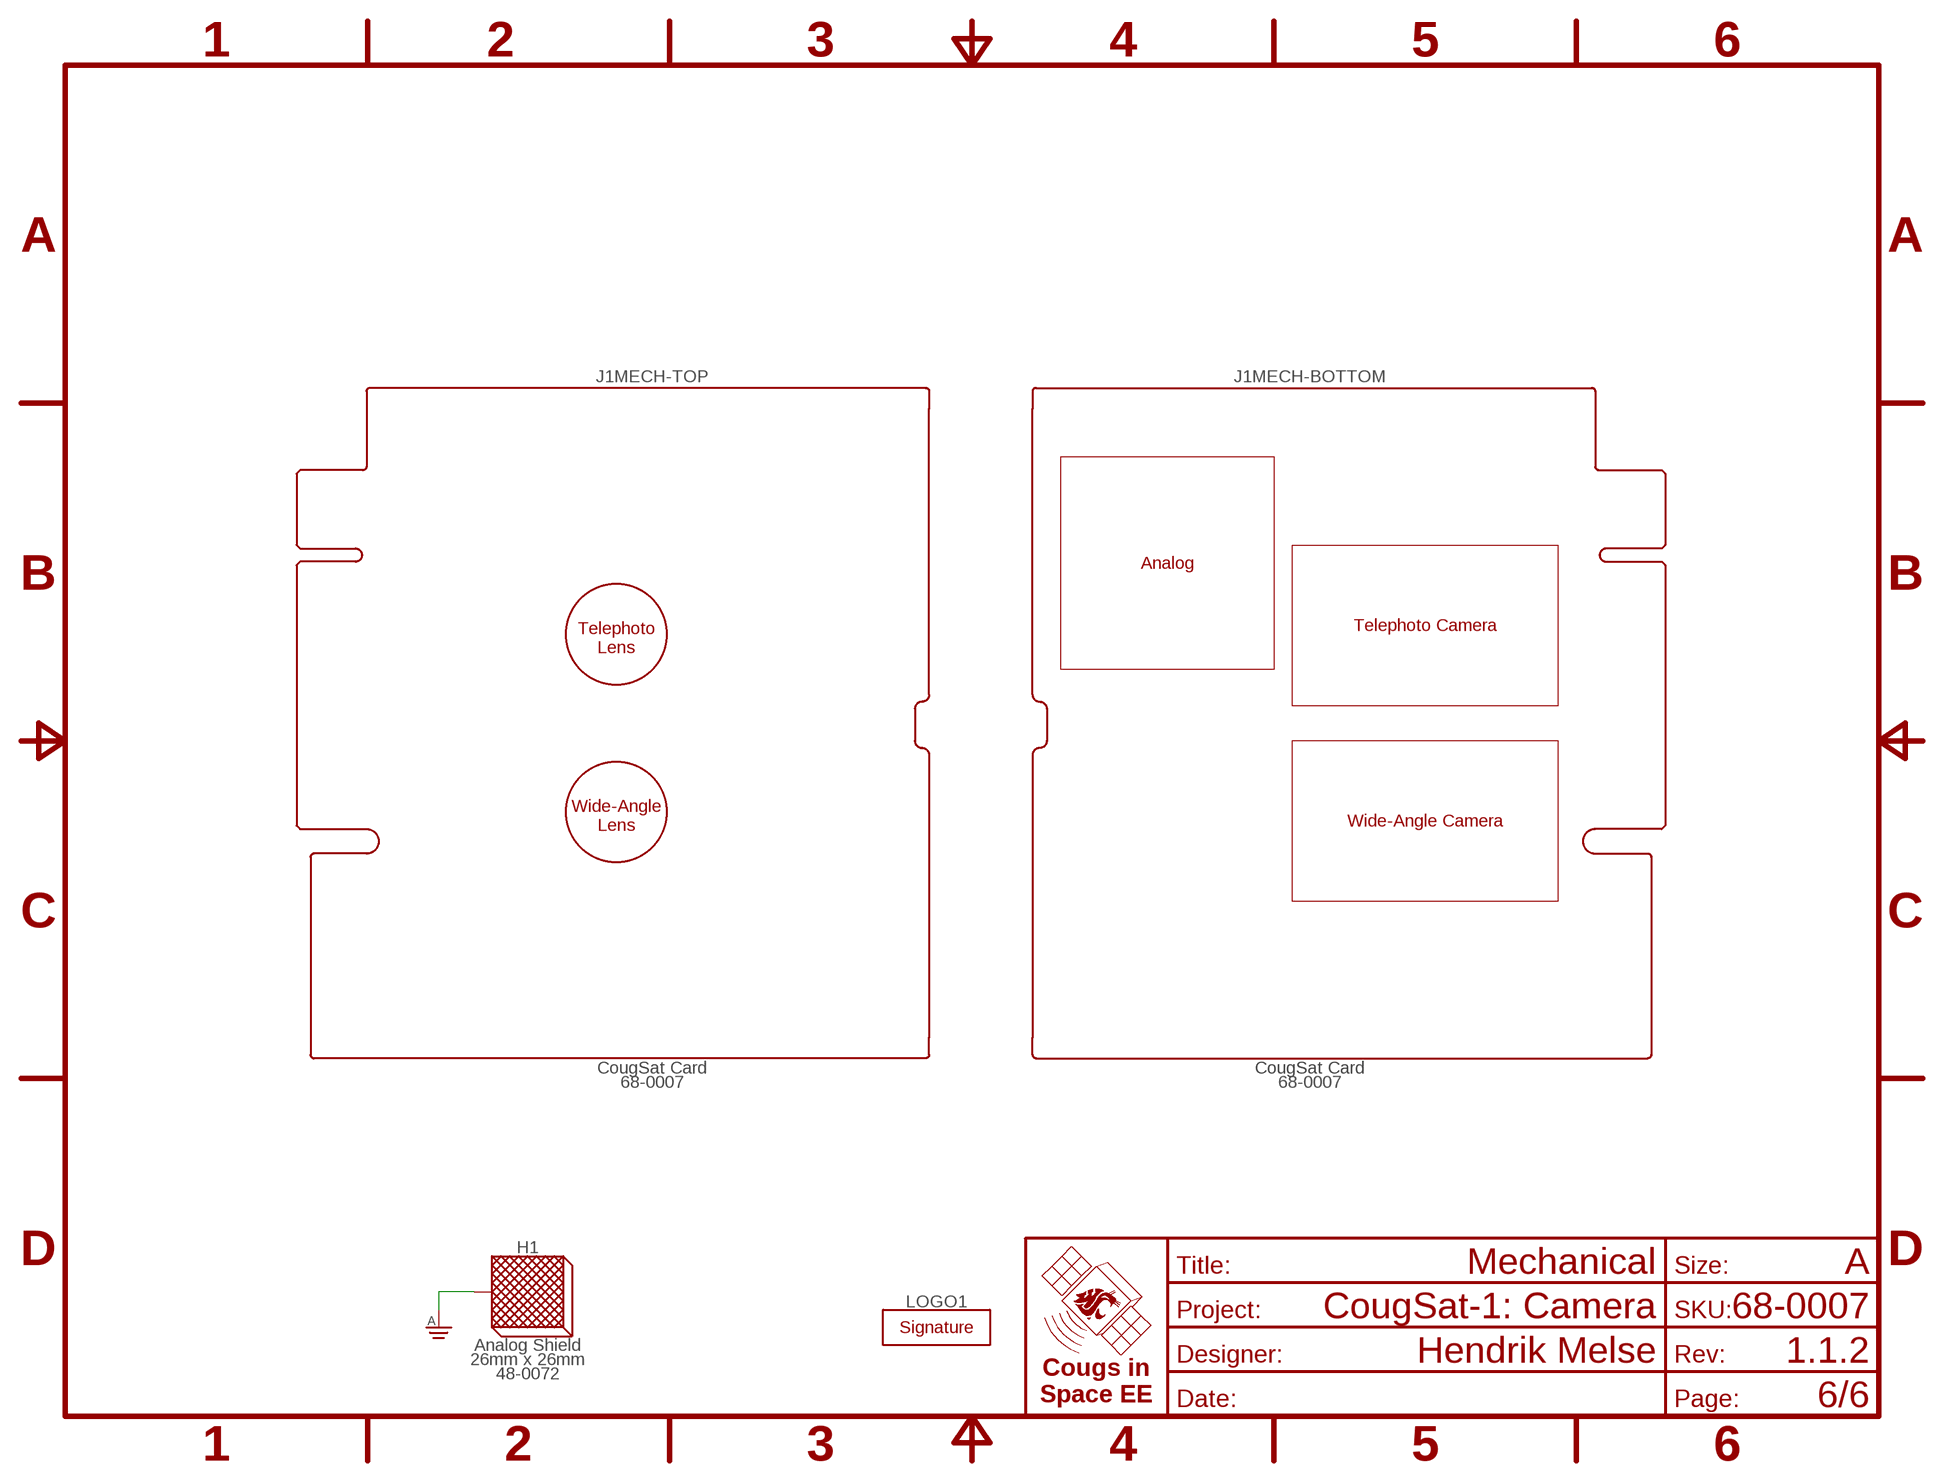
[diagram p5: schematic, sheet 6]
FRAME4 (FRAME-A): TITLE: Mechanical

### Parts
H1  Analog Shield  SHIELDING-2626  [SHIELD-2626]
LOGO1  SIGNATUREHENDRIK  [SIGN-HENDRIK]

### Nets
AGND: H1.1(SHIELD) H1.2(SHIELD) H1.3(SHIELD) H1.4(SHIELD) H1.5(SHIELD) H1.6(SHIELD) H1.7(SHIELD) H1.8(SHIELD) H1.9(SHIELD) H1.10(SHIELD) H1.11(SHIELD) H1.12(SHIELD) H1.13(SHIELD) H1.14(SHIELD) H1.15(SHIELD) H1.16(SHIELD) H1.17(SHIELD) H1.18(SHIELD) H1.19(SHIELD) H1.20(SHIELD) ; also sheet 3,4

### Notes on the sheet
- Analog
- Telephoto Camera
- Telephoto
  Lens
- Wide-Angle
  Lens
- Wide-Angle Camera

## Power pins joined to a net without a drawn wire
PR_3.3V-1: J1.A2(POWER:PR_3.3V-1) J1.B2(POWER:PR_3.3V-1)
PR_3.3V-2: J1.A3(POWER:PR_3.3V-2) J1.B3(POWER:PR_3.3V-2)
PR_3.3V-3: J1.A4(POWER:PR_3.3V-3) J1.B4(POWER:PR_3.3V-3)
PR_3.3V-4: J1.A5(POWER:PR_3.3V-4) J1.B5(POWER:PR_3.3V-4)
PR_3.3V-5: J1.A6(POWER:PR_3.3V-5) J1.B6(POWER:PR_3.3V-5)
PR_3.3V-6: J1.A7(POWER:PR_3.3V-6) J1.B7(POWER:PR_3.3V-6)
PR_3.3V-7: J1.A8(POWER:PR_3.3V-7) J1.B8(POWER:PR_3.3V-7)
PR_3.3V-8: J1.A9(POWER:PR_3.3V-8) J1.B9(POWER:PR_3.3V-8)
PR_3.3V-9: J1.A10(POWER:PR_3.3V-9) J1.B10(POWER:PR_3.3V-9)
PR_BATT-0: J1.A14(POWER:PR_BATT-0) J1.B14(POWER:PR_BATT-0)
PR_BATT-1: J1.A15(POWER:PR_BATT-1) J1.B15(POWER:PR_BATT-1)
PR_BATT-2: J1.A16(POWER:PR_BATT-2) J1.B16(POWER:PR_BATT-2)
PR_BATT-3: J1.A17(POWER:PR_BATT-3) J1.B17(POWER:PR_BATT-3)
PR_BATT-4: J1.A18(POWER:PR_BATT-4) J1.B18(POWER:PR_BATT-4)
PR_BATT-5: J1.A19(POWER:PR_BATT-5) J1.B19(POWER:PR_BATT-5)
PR_BATT-6: J1.A20(POWER:PR_BATT-6) J1.B20(POWER:PR_BATT-6)

## Library data of the parts
B1 = CougsInSpace-Sensors:ARDUCAM: ArduCam Module; LENS: 1.7mm f2.8; SKU: 66-0005
B2 = CougsInSpace-Sensors:ARDUCAM: ArduCam Module; LENS: 12mm f2.8; SKU: 66-0005
C1 C2 C6-C14 C18-C21 C23 = CougsInSpace-Capacitors:CAP-V: Capacitor - Vertical Orientation; PACKAGE: 1608; SKU: 11-104A; TEMP: X7R; VOLTAGE: 50V
C3 C4 = CougsInSpace-Capacitors:CAP-V: Capacitor - Vertical Orientation; PACKAGE: 1608; SKU: 11-105A; TEMP: X5R; VOLTAGE: 6.3V
C5 C15 C22 C25 C27 = CougsInSpace-Capacitors:CAP-V: Capacitor - Vertical Orientation; PACKAGE: 1608; SKU: 11-106A; TEMP: X5R; VOLTAGE: 6.3V
C16 = CougsInSpace-Capacitors:CAP-H: Capacitor - Horizontal Orientation; PACKAGE: 1608; SKU: 11-2.0A; TEMP: C0G; VOLTAGE: 250V
C17 = CougsInSpace-Capacitors:CAP-H: Capacitor - Horizontal Orientation; PACKAGE: 1608; SKU: 11-102A; TEMP: X7R; VOLTAGE: 50V
C24 = CougsInSpace-Capacitors:CAP-POL-V: Capacitor Polarized - Vertical Orientation; ESR: Max 900mΩ; PACKAGE: Tant-B; SKU: 16-475A; VOLTAGE: 20V
C26 = CougsInSpace-Capacitors:CAP-V: Capacitor - Vertical Orientation; PACKAGE: 1608; SKU: 11-105B; TEMP: X7R; VOLTAGE: 16V
C28 = CougsInSpace-Capacitors:CAP-V: Capacitor - Vertical Orientation; PACKAGE: 1608; SKU: 11-103A; TEMP: X7R; VOLTAGE: 50V
C29 = CougsInSpace-Capacitors:CAP-POL-V: Capacitor Polarized - Vertical Orientation; ESR: Max 400mΩ; PACKAGE: Tant-B; SKU: 16-476A; VOLTAGE: 10V
C30 = CougsInSpace-Capacitors:CAP-V: Capacitor - Vertical Orientation; PACKAGE: 1608; SKU: 11-4.7A; TEMP: C0G; VOLTAGE: 50V
D1 = CougsInSpace-Sensors:PHOTODIODE: Photodiode; HALF_ANGLE: ±180°; SENSITIVITY: 5-1000keV; SKU: 66-0004; VR: 50V
FB1 = CougsInSpace-Coils:CHOKE-H: Choke (Ferrite Bead) Horizontal; CURRENT: 500mA; DCR: 500mΩ; PACKAGE: 1608; SKU: 36-152A
H1 = CougsInSpace-Hardware:SHIELDING: Board Level Shielding; PACKAGE: 26mm x 26mm; SKU: 48-0072
J1 = CougsInSpace-Boards:CIS_CARD-OPEN+X: CougSat Card - Open +X; SKU: 68-0007
L1 = CougsInSpace-Coils:INDUCTOR-H: Inductor Horizontal; CURRENT: 9A; DCR: 30.00mΩ; PACKAGE: 7575; SKU: 34-472A
LOGO1 = CougsInSpace-Aesthetics:SIGNATURE: Designer's (Artist's) Signature
R1 = CougsInSpace-Resistors:RES-V: Resistor Vertical; PACKAGE: 1608; POWER: 1/5W; SKU: 21-2002; TEMP: 50ppm/°C
R2 R11 = CougsInSpace-Resistors:RES-V: Resistor Vertical; PACKAGE: 1608; POWER: 1/8W; SKU: 21-1002; TEMP: 25ppm/°C
R3 = CougsInSpace-Resistors:RES-V: Resistor Vertical; PACKAGE: 1608; POWER: 1/8W; SKU: 21-4702; TEMP: 25ppm/°C
R4 = CougsInSpace-Resistors:RES-H: Resistor Horizontal; PACKAGE: 1608; POWER: 1/10W; SKU: 21-1004; TEMP: 100ppm/°C
R5 = CougsInSpace-Resistors:RES-V: Resistor Vertical; PACKAGE: 1608; POWER: 1/10W; SKU: 21-2201; TEMP: 100ppm/°C
R6 = CougsInSpace-Resistors:RES-V: Resistor Vertical; PACKAGE: 1608; POWER: 1/10W; SKU: 21-7502; TEMP: 10ppm/°C
R7 = CougsInSpace-Resistors:RES-H: Resistor Horizontal; PACKAGE: 1608; POWER: 1/10W; SKU: 21-1005; TEMP: 50ppm/°C
R8 = CougsInSpace-Resistors:RES-H: Resistor Horizontal; PACKAGE: 1608; POWER: 1/8W; SKU: 21-1002; TEMP: 25ppm/°C
R9 R10 R13 R14 = CougsInSpace-Resistors:RES-V: Resistor Vertical; PACKAGE: 1608; POWER: 1/10W; SKU: 21-0000; TEMP: 70°C Max 2A
R12 = CougsInSpace-Resistors:RES-V: Resistor Vertical; PACKAGE: 1608; POWER: 1/10W; SKU: 21-1004; TEMP: 100ppm/°C
R15 = CougsInSpace-Resistors:RES-V: Resistor Vertical; PACKAGE: 1608; POWER: 1/8W; SKU: 21-1003; TEMP: 25ppm/°C
RN1 = CougsInSpace-Resistors:RES_BUS-10: Resistor Bussed Array All resistors share a common terminal; PACKAGE: 3264; POWER: 1/16W; SKU: 26-0001; TEMP: 200ppm/°C
RT1-RT8 = CougsInSpace-Resistors:THERMISTOR-V: Thermistor Vertical; B2585: 3960K 1%; PACKAGE: 1608; SKU: 26-0008
TP1-TP7 = CougsInSpace-Connectors:TEST_POINT: Test Point Used to probe points in a circuit for debugging or general measurement
U1 = CougsInSpace-IC-Conversion:AD7291: AD7291 12b ADC with 8-single ended channels. I²C interface; SKU: 27-0003
U2 U10 = CougsInSpace-IC-Amplifiers:OPAMP-1: Operational Amplifier - Single; SKU: 08-0002
U3-U5 U7 U9 U12 U13 = CougsInSpace-IC-Comms:LEVEL_SHIFTER-2BIT: Logic Level Shifter Bidirectional - 2b; SKU: 09-0001
U6 = CougsInSpace-IC-Conversion:TCA9535: IO Expander - 16b I²C in, 16 GPIO out TCA9535 <https://github.com/CougsInSpace/Resources/blob/master/SupplierDocuments/Ti/TCA9535.pdf>; SKU: 27-0001
U8 = CougsInSpace-IC-Logic:COUNTER_BINARY-12BIT: Binary Counter - 12b CDx4HCx4040 <https://github.com/CougsInSpace/Resources/blob/master/SupplierDocuments/Ti/CD74HC4040.pdf>; SKU: 28-0004
U11 = CougsInSpace-IC-Amplifiers:OPAMP-2: Operational Amplifier - Double; SKU: 08-0005
U14 = CougsInSpace-IC-Power:TPS61220: DC/DC Converter Boost 200mA TPS61220 <https://github.com/CougsInSpace/Resources/blob/master/SupplierDocuments/Ti/TPS61220_BoostConverter.pdf>; SKU: 60-0007
U15 = CougsInSpace-IC-Power:LDO-FB: Low Dropout Linear Regulator - with Feedback; IMAX: 250mA; SKU: 60-0012; VDO: 150mV; VOUT: 5.0V

## Board
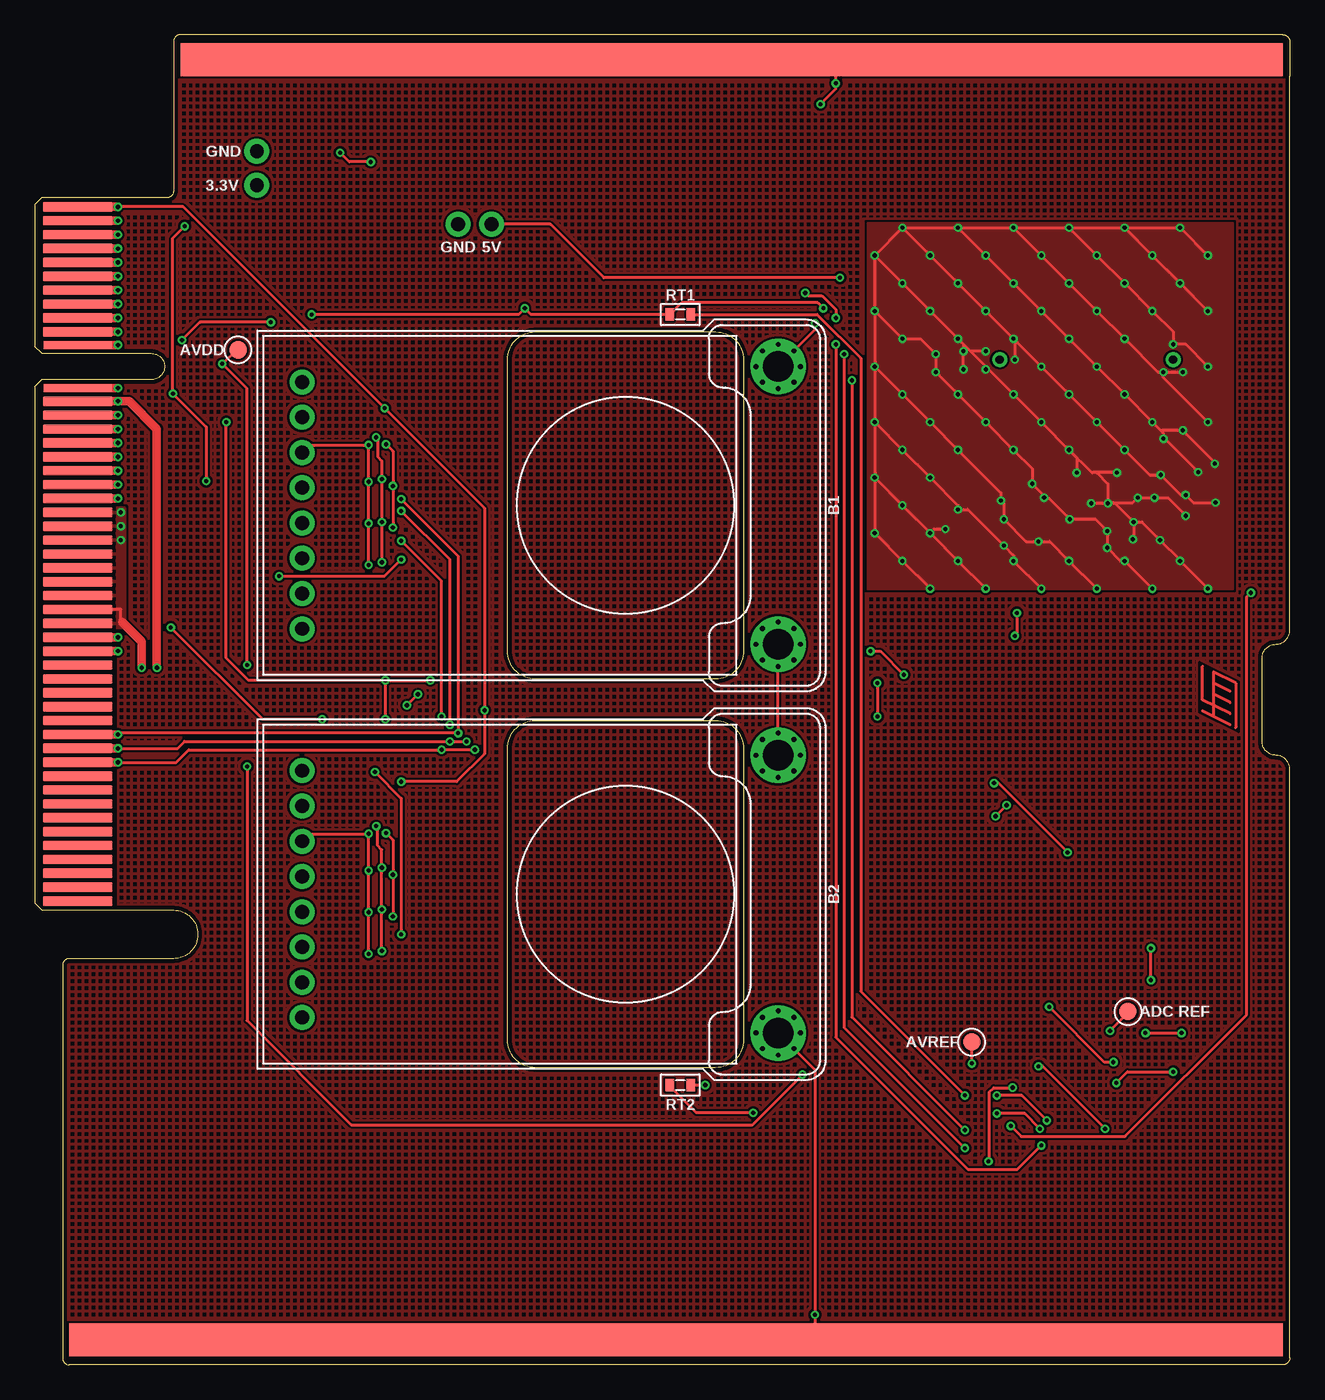
[diagram p6: board, top side]
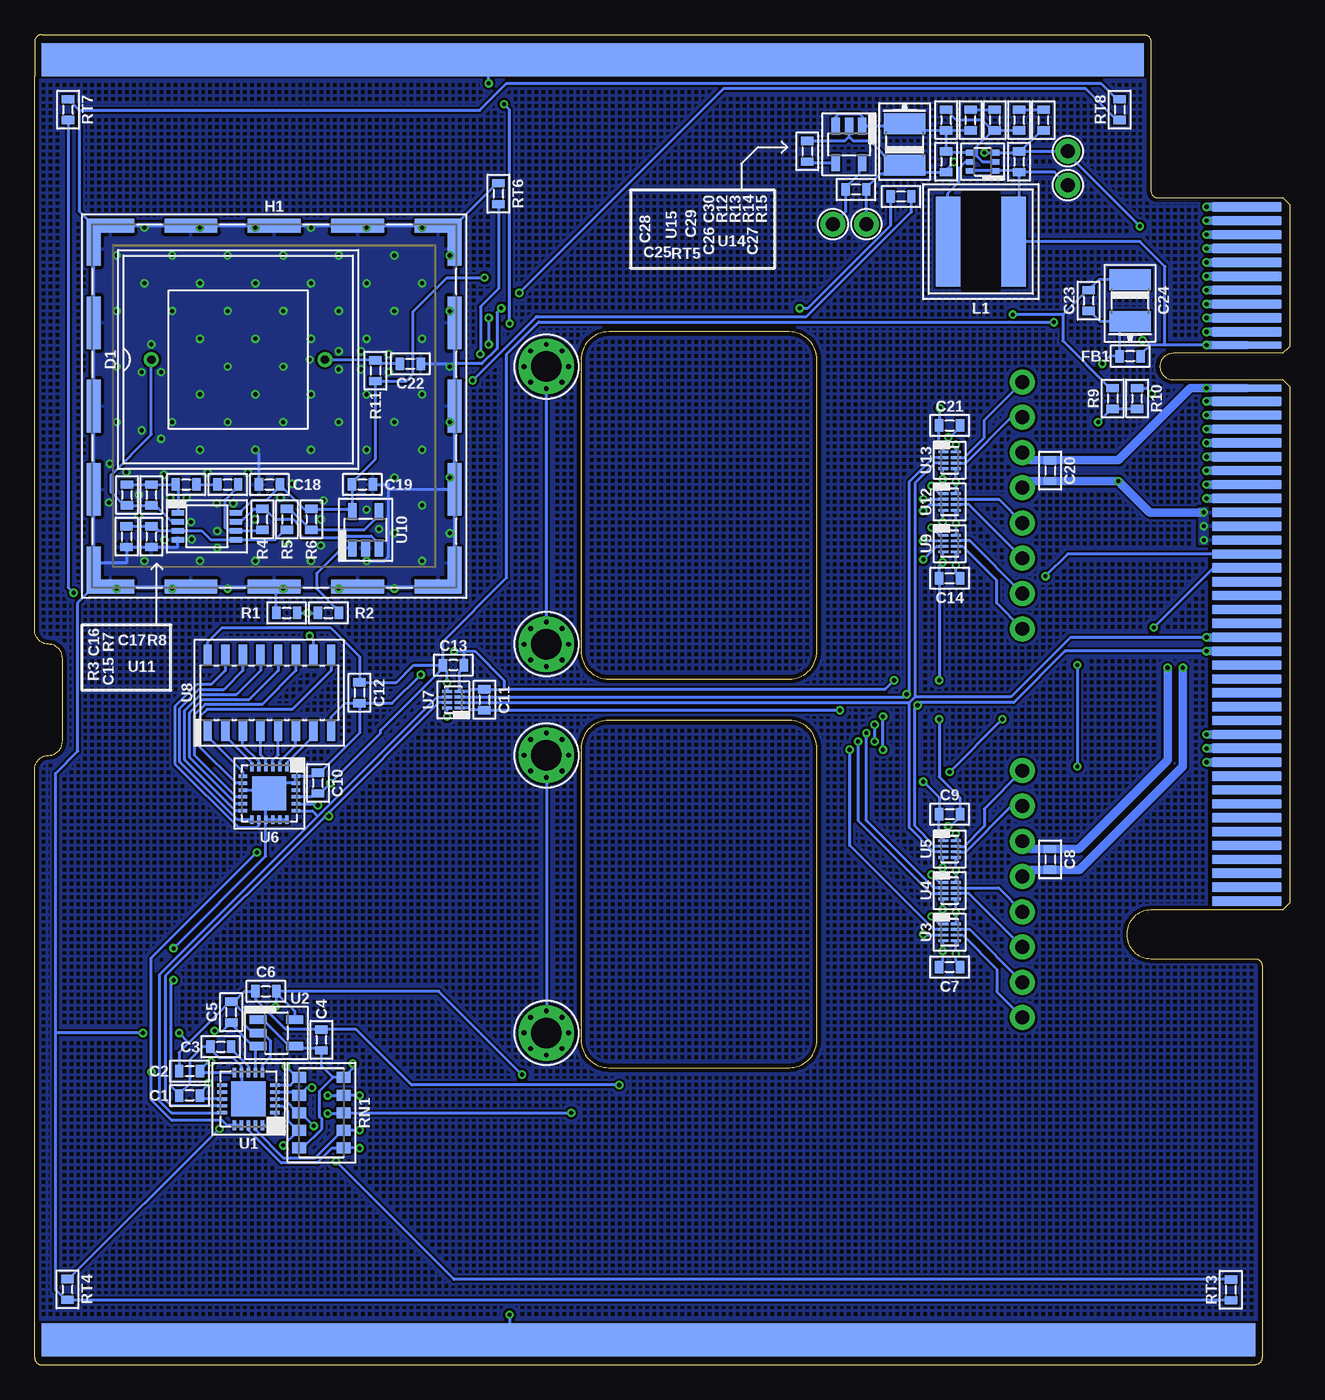
[diagram p7: board, bottom side, seen from below]

Size 90.4 x 95.8 mm. Coordinates in mm from the lower left corner, seen from the top.
Outline: 90.4,3 90.4,42.9 arc90 89.4,43.9 arc-90 88.4,44.9 88.4,50.9 arc-90 89.4,51.9 arc90 90.4,52.9 90.4,92.8
Copper layers (1*16): Top 0.035mm / dielectric 1.6mm / Bottom 0.035mm
Design rules "CougsInSpace": minimum track width 0.16mm, minimum drill 0.3mm, track to track 0.16mm, track to pad 0.16mm, pad to pad 0.16mm, via to via 0.16mm, smd to smd 0mil, copper to edge 0.3mm, drill to drill 0.3mm, minimum pad ring 0.15mm, minimum via ring 0.15mm, stop-mask expansion 0mil, vias tented up to drill 1mm, thermal gap 0.25mm

### Footprints (pad centres in the part's own frame; a part is rotated, then mirrored left to right if it is on the bottom)
ARDUCAM = drill 1: 1 8.89,0; 2 6.35,0; 3 3.81,0; 4 1.27,0; 5 -1.27,0; 6 -3.81,0; 7 -6.35,0; 8 -8.89,0 | drill 2.2 pad 4: CHASSIS@1 -10,34.3; CHASSIS@10 10,34.3 | drill 0.35 pad 0.6: CHASSIS@2 -10,35.9; CHASSIS@3 -11.131,35.431; CHASSIS@4 -11.6,34.3; CHASSIS@5 -11.131,33.169; CHASSIS@6 -10,32.7; CHASSIS@7 -8.869,33.169; CHASSIS@8 -8.4,34.3; CHASSIS@9 -8.869,35.431; CHASSIS@11 10,35.9; CHASSIS@12 8.869,35.431; CHASSIS@13 8.4,34.3; CHASSIS@14 8.869,33.169; CHASSIS@15 10,32.7; CHASSIS@16 11.131,33.169; CHASSIS@17 11.6,34.3; CHASSIS@18 11.131,35.431
1608 = smd 0.6 x 0.9: 1 -0.75,0; 2 0.75,0
4028-POL = smd 1.5 x 3: A 1.5,0; C -1.5,0
X100-7-THD = drill 0.6: A 0,6.25; C 0,-6.25
SHIELD-2626 = smd 1 x 2.4: 1 -13,11.3; 5 -13,-11.3; 11 13,-11.3; 15 13,11.3 | smd 1 x 3.8: 2 -13,6; 3 -13,0; 4 -13,-6; 12 13,-6; 13 13,0; 14 13,6 | smd 3.4 x 1: 6 -11.8,-13; 10 11.8,-13; 16 11.8,13; 20 -11.8,13 | smd 3.8 x 1: 7 -6,-13; 8 0,-13; 9 6,-13; 17 6,13; 18 0,13; 19 -6,13
CARD-FULL-OPEN+X = smd 5 x 0.7 bottom: A1 3.1,35.5; A2 3.1,34.5; A3 3.1,33.5; A4 3.1,32.5; A5 3.1,31.5; A6 3.1,30.5; A7 3.1,29.5; A8 3.1,28.5; A9 3.1,27.5; A10 3.1,26.5; A13 3.1,21.5; A14 3.1,20.5; A15 3.1,19.5; A16 3.1,18.5; A17 3.1,17.5; A18 3.1,16.5; A19 3.1,15.5; A20 3.1,14.5; A21 3.1,13.5; A22 3.1,12.5; A23 3.1,11.5; A24 3.1,10.5; A25 3.1,9.5; A26 3.1,8.5; A27 3.1,7.5; A28 3.1,6.5; A29 3.1,5.5; A30 3.1,4.5; A31 3.1,3.5; A32 3.1,2.5; A33 3.1,1.5; A34 3.1,0.5; A35 3.1,-0.5; A36 3.1,-1.5; A37 3.1,-2.5; A38 3.1,-3.5; A39 3.1,-4.5; A40 3.1,-5.5; A41 3.1,-6.5; A42 3.1,-7.5; A43 3.1,-8.5; A44 3.1,-9.5; A45 3.1,-10.5; A46 3.1,-11.5; A47 3.1,-12.5; A48 3.1,-13.5; A49 3.1,-14.5 | smd 5 x 0.6 bottom: A11 3.1,25.55; A12 3.1,22.45 | smd 5 x 0.7: B1 3.1,35.5; B2 3.1,34.5; B3 3.1,33.5; B4 3.1,32.5; B5 3.1,31.5; B6 3.1,30.5; B7 3.1,29.5; B8 3.1,28.5; B9 3.1,27.5; B10 3.1,26.5; B13 3.1,21.5; B14 3.1,20.5; B15 3.1,19.5; B16 3.1,18.5; B17 3.1,17.5; B18 3.1,16.5; B19 3.1,15.5; B20 3.1,14.5; B21 3.1,13.5; B22 3.1,12.5; B23 3.1,11.5; B24 3.1,10.5; B25 3.1,9.5; B26 3.1,8.5; B27 3.1,7.5; B28 3.1,6.5; B29 3.1,5.5; B30 3.1,4.5; B31 3.1,3.5; B32 3.1,2.5; B33 3.1,1.5; B34 3.1,0.5; B35 3.1,-0.5; B36 3.1,-1.5; B37 3.1,-2.5; B38 3.1,-3.5; B39 3.1,-4.5; B40 3.1,-5.5; B41 3.1,-6.5; B42 3.1,-7.5; B43 3.1,-8.5; B44 3.1,-9.5; B45 3.1,-10.5; B46 3.1,-11.5; B47 3.1,-12.5; B48 3.1,-13.5; B49 3.1,-14.5 | smd 5 x 0.6: B11 3.1,25.55; B12 3.1,22.45 | smd 79.4 x 2.4 bottom: CHASSIS@1 50.2,46.1 | smd 79.4 x 2.4: CHASSIS@2 50.2,46.1 | smd 87.4 x 2.4 bottom: CHASSIS@3 46.2,-46.1 | smd 87.4 x 2.4: CHASSIS@4 46.2,-46.1
7575 = smd 1.78 x 6.5: 1 -2.36,0; 2 2.36,0
3264 = smd 0.79 x 1: 1 -2.54,-1.6; 2 -1.27,-1.6; 3 0,-1.6; 4 1.27,-1.6; 5 2.54,-1.6; 6 2.54,1.6; 7 1.27,1.6; 8 0,1.6; 9 -1.27,1.6; 10 -2.54,1.6
SMD-C-1.25 = smd 1.25 x 1.25: 1 0,0
THT-1.0 = drill 1 pad 1.8: 1 0,0
QFN-20-4040 = smd 0.7 x 0.25: 1 -1.9,1; 2 -1.9,0.5; 3 -1.9,0; 4 -1.9,-0.5; 5 -1.9,-1; 11 1.9,-1; 12 1.9,-0.5; 13 1.9,0; 14 1.9,0.5; 15 1.9,1 | smd 0.25 x 0.7: 6 -1,-1.9; 7 -0.5,-1.9; 8 0,-1.9; 9 0.5,-1.9; 10 1,-1.9; 16 1,1.9; 17 0.5,1.9; 18 0,1.9; 19 -0.5,1.9; 20 -1,1.9 | smd 2.5 x 2.5: PAD 0,0
SOT23-5 = smd 1.22 x 0.62: 1 -1.31,0.95; 2 -1.31,0; 3 -1.31,-0.95; 4 1.31,-0.95; 5 1.31,0.95
X2SON-8 = smd 0.2 x 0.7: 1 0.6,0.45; 2 0.2,0.45; 3 -0.2,0.45; 4 -0.6,0.45; 5 -0.6,-0.45; 6 -0.2,-0.45; 7 0.2,-0.45; 8 0.6,-0.45
QFN-24-4040 = smd 0.6 x 0.25: 1 -1.9,1.25; 2 -1.9,0.75; 3 -1.9,0.25; 4 -1.9,-0.25; 5 -1.9,-0.75; 6 -1.9,-1.25; 13 1.9,-1.25; 14 1.9,-0.75; 15 1.9,-0.25; 16 1.9,0.25; 17 1.9,0.75; 18 1.9,1.25 | smd 0.25 x 0.6: 7 -1.25,-1.9; 8 -0.75,-1.9; 9 -0.25,-1.9; 10 0.25,-1.9; 11 0.75,-1.9; 12 1.25,-1.9; 19 1.25,1.9; 20 0.75,1.9; 21 0.25,1.9; 22 -0.25,1.9; 23 -0.75,1.9; 24 -1.25,1.9 | smd 2.45 x 2.45: PAD 0,0
SO16 = smd 1.55 x 0.6: 1 -2.7,4.445; 2 -2.7,3.175; 3 -2.7,1.905; 4 -2.7,0.635; 5 -2.7,-0.635; 6 -2.7,-1.905; 7 -2.7,-3.175; 8 -2.7,-4.445; 9 2.7,-4.445; 10 2.7,-3.175; 11 2.7,-1.905; 12 2.7,-0.635; 13 2.7,0.635; 14 2.7,1.905; 15 2.7,3.175; 16 2.7,4.445
MSOP-8 = smd 0.9 x 0.4: 1 -2.1,0.975; 2 -2.1,0.325; 3 -2.1,-0.325; 4 -2.1,-0.975; 5 2.1,-0.975; 6 2.1,-0.325; 7 2.1,0.325; 8 2.1,0.975
SOT363 = smd 0.5 x 0.4: 1 -0.95,0.65; 2 -0.95,0; 3 -0.95,-0.65; 4 0.95,-0.65; 5 0.95,0; 6 0.95,0.65

### Placement (x,y rotation side)
B1  19.25,61.9 270 top
B2  19.25,33.9 270 top
C1  79.25,19.4 180 bottom
C2  79.25,21.15 180 bottom
C3  77,22.9 180 bottom
C4  69.75,23.4 90 bottom
C5  76.25,25.4 90 bottom
C6  73.75,26.9 180 bottom
C7  24.5,28.65 180 bottom
C8  17.25,36.4 270 bottom
C9  24.5,39.65 0 bottom
C10  70,41.9 90 bottom
C11  58,47.9 90 bottom
C12  67,48.4 270 bottom
C13  60.25,50.4 0 bottom
C14  24.5,56.65 180 bottom
C15  82,59.65 270 bottom
C16  83.75,62.65 90 bottom
C17  79.5,63.4 0 bottom
C18  73.5,63.4 180 bottom
C19  66.8,63.4 0 bottom
C20  17.25,64.4 270 bottom
C21  24.5,67.65 0 bottom
C22  63.35,72.1 0 bottom
C23  14.5,76.65 90 bottom
C24  11.5,76.65 270 bottom
C25  31.25,84.65 0 bottom
C26  24.75,86.65 270 bottom
C27  19.5,86.65 90 bottom
C28  34.75,87.4 90 bottom
C29  27.75,87.9 90 bottom
C30  24.75,89.65 90 bottom
D1  75.75,72.4 90 bottom
FB1  11.5,72.65 180 bottom
H1  73.15,69.05 0 bottom
J1  0,47.9 0 top
L1  22.25,80.9 180 bottom
LOGO1  85.3,48.1 90 top
R1  72.25,54.15 0 bottom
R2  69.25,54.15 0 bottom
R3  83.78,59.65 90 bottom
R4  74,60.9 90 bottom
R5  72.22,60.9 90 bottom
R6  70.47,60.9 90 bottom
R7  82,62.65 90 bottom
R8  76.5,63.4 0 bottom
R9  12.75,69.6 270 bottom
R10  11,69.6 270 bottom
R11  65.85,71.6 270 bottom
R12  23,89.65 270 bottom
R13  21.25,89.65 90 bottom
R14  19.5,89.65 270 bottom
R15  17.75,89.65 90 bottom
RN1  69.75,18.15 270 bottom
RT1  46.5,75.65 0 top
RT2  46.5,20.15 180 top
RT3  4.25,5.4 90 bottom
RT4  88.04,5.43 90 bottom
RT5  28,84.15 0 bottom
RT6  57,84.35 270 bottom
RT7  88,90.4 270 bottom
RT8  12.25,90.4 270 bottom
TP1  14.65,73.1 180 top
TP2  78.75,25.45 0 top
TP3  67.5,23.25 0 top
TP4  32.9,82.15 0 bottom
TP5  30.5,82.15 0 bottom
TP6  16,84.95 0 bottom
TP7  16,87.4 0 bottom
U1  75,19.15 180 bottom
U2  73,23.9 0 bottom
U3  24.5,31.15 90 bottom
U4  24.5,34.15 90 bottom
U5  24.5,37.15 90 bottom
U6  73.5,41.15 270 bottom
U7  60.25,47.9 270 bottom
U8  73.5,48.4 90 bottom
U9  24.5,59.15 90 bottom
U10  66.57,60.14 90 bottom
U11  78,60.4 0 bottom
U12  24.5,62.15 90 bottom
U13  24.5,65.15 90 bottom
U14  22.12,86.65 180 bottom
U15  31.75,87.9 270 bottom

### Tracks (layer width: path | path; a pad name or v marks a point on that pad's centre or on a via)
3.3V_0  (via drill 0.3)
  Top 0.2: v25.3,66.3 25.8,65.8 v25.8,63.3 v25.8,60.3 | v25.3,38.3 25.8,37.8 v25.8,35.3 v25.8,32.3 | v6,83.4 10.7,83.4 v25.2,68.9 32.4,61.7 v32.4,47.14 32.4,44 30.4,42 v26.4,42
  Top 0.6: J1.A1 v6,83.4
  Bottom 0.2: v25.8,63.3 25.25,62.75 U12.1 | v25.8,60.3 25.25,59.75 U9.1 | v25.8,32.3 25.25,31.75 U3.1 | U4.1 25.25,34.75 v25.8,35.3 | U13.1 24.95,65.95 v25.3,66.3 25.3,67.6 C21.1 25.25,68.85 v25.2,68.9 | U5.1 24.95,37.95 v25.3,38.3 25.3,39.6 C9.1 25.25,40.85 v26.4,42 | U7.1 59.1,47.3 58.95,47.15 C11.1 v32.41,47.15 v32.4,47.14
  Bottom 0.6: v6,83.4 J1.A1
3.3V_10  (via drill 0.3)
  Top 0.2: v60.7,49.1 v60.7,46.7 | v82,21.1 78.7,21.1 v77.9,20.3 | v74.4,36.9 69.4,41.9 v69.1,41.9 | v17,75.09 11.89,75.09 v10.6,73.8
  Top 0.6: J1.A11 v6,73.45
  Bottom 0.2: C27.1 19.6,86 U14.1 U14.6 | C27.1 19.5,81.29 L1.1 10.8,80.9 9,79.1 9,73.45 | U1.17 U1.16 76.55,17.25 76.9,17.6 80.52,17.6 82,19.08 v82,21.1 82,29.3 v74.4,36.9 | U1.13 78.25,19.15 C1.1 78.5,19.6 77.9,20.2 v77.9,20.3 | U7.5 v60.7,49.1 60.7,49.9 61,50.2 | v60.7,46.7 U7.8 | U6.21 70.45,40.9 70.2,41.15 C10.1 69.85,41.15 v69.1,41.9 65.5,45.5 65.5,45.7 61,50.2 | C27.1 16.95,85.9 TP6.1 | 61,50.2 C13.1 | v6,73.45 9,73.45 | 9,73.45 10.05,73.45 | FB1.1 10.75,72.75 10.05,73.45 | U8.16 77.94,52.05 76.9,53.1 69.1,53.1 67,51 C12.1 64.35,49.15 63.1,50.4 C13.1 | C13.1 61,52.1 56.4,56.7 56.4,72.8 54.1,75.1 20.19,75.1 20.18,75.09 v17,75.09 | v10.6,73.8 10.4,73.8 10.05,73.45
  Bottom 0.6: v6,73.45 J1.A11
3.3V_11  (via drill 0.3)
  Top 0.2: v24.05,57.6 v24.05,60.6 v24.05,63.6 v24.05,66.25 19.79,66.25 B1.6
  Top 0.6: v6,70.35 J1.B12
  Bottom 0.2: C14.1 24.05,56.95 v24.05,57.6 U9.5 | v24.05,66.25 U13.8 | U13.5 v24.05,63.6 U12.8 | U12.5 v24.05,60.6 U9.8
  Bottom 0.6: J1.B12 v6,70.35 7.15,70.35 12.35,65.15 C20.1 18.69,65.15 B1.6
3.3V_12  (via drill 0.3)
  Top 0.2: v24.05,29.6 v24.05,32.6 v24.05,35.6 v24.05,38.25 19.79,38.25 B2.6
  Top 0.6: J1.B13 v6,69.4 6.8,69.4 8.8,67.4 v8.8,50.2
  Bottom 0.2: C7.1 24.05,28.95 v24.05,29.6 U3.5 | U3.8 v24.05,32.6 U4.5 | U4.8 v24.05,35.6 U5.5 | v24.05,38.25 U5.8
  Bottom 0.6: v6,69.4 J1.B13 | B2.6 18.69,37.15 C8.1 15.2,37.15 8.8,43.55 v8.8,50.2
5.0V  (via drill 0.3)
  Top 0.2: TP4.1 37.15,82.15 41,78.3 v58,78.3
  Bottom 0.2: U15.5 31,86.39 31,85.8 32,84.8 C25.1 32,83.05 TP4.1 | U11.8 75.62,61.38 74.7,62.3 73.7,62.3 72.75,63.25 C18.1 71,61.65 R6.2 67.72,61.65 67.64,61.56 | 67.64,61.56 U10.5 | 67.64,61.56 67.64,61.6 67.55,61.69 C19.1 67.55,63.55 65.85,65.25 R11.2 63.65,70.85 63.16,71.34 63.16,75.84 60.7,78.3 v58,78.3
!CS-CAM0
  Bottom 0.2: U3.6 23.56,30.95 21.1,28.49 21.1,26.86 B2.1
!CS-CAM1
  Bottom 0.2: B1.1 21.1,54.86 21.1,56.49 23.56,58.95 U9.6
!CS-TELEPHOTO  (via drill 0.3)
  Top 0.2: v17.6,56.8 25.2,56.8 v26.4,58
  Bottom 0.2: J1.A24 16,58.4 v17.6,56.8 | v26.4,58 25.45,58.95 U9.3
!CS-WIDE_ANGLE  (via drill 0.3)
  Top 0.2: v9.8,53.1 16.4,46.5 v20.7,46.5 | v24.5,42.7 26.4,40.8 v26.4,31
  Bottom 0.2: J1.A25 5.5,57.4 v9.8,53.1 | v24.5,42.7 v20.7,46.5 | v26.4,31 26.35,30.95 U3.3
ADC_DCAP
  Bottom 0.2: C3.1 76.25,22.76 75,21.51 U1.8
ADC_VREF  (via drill 0.3)
  Top 0.2: v77.45,24.05 78.75,25.35 TP2.1
  Bottom 0.2: U1.7 74.5,22.76 U2.3 74.65,22.95 76.25,24.55 C5.1 76.85,24.05 v77.45,24.05
AGND  (via drill 0.3)
  Top 0.2: v56.8,76.1 56.4,76.5 46.6,76.5 RT1.1 35.75,75.65 v35.3,76.1 34.85,75.65 v19.95,75.65 | RT2.1 v48.3,20.15 | v80,23.9 v82.6,23.9 | v62.5,81.9 v60.5,79.9 | v62.5,81.9 v66.5,81.9 | v66.5,81.9 v70.5,81.9 | v74.5,81.9 v78.5,81.9 | v78.5,81.9 v82.5,81.9 v84.5,79.9 | v84.5,75.9 v82.5,77.9 v80.5,79.9 v78.5,81.9 | v70.5,81.9 v74.5,81.9 | v74.5,81.9 v76.5,79.9 v78.5,77.9 v80.5,75.9 82,74.4 v82,73.5 82.9,73.5 v84.5,71.9 | v70.5,81.9 v72.5,79.9 v74.5,77.9 v76.5,75.9 v78.5,73.9 80.9,71.5 v81.3,71.5 | v81.3,71.5 v82.7,71.5 | v84.5,67.9 81.3,71.1 v81.3,71.5 | v66.5,81.9 v68.5,79.9 v70.5,77.9 v72.5,75.9 v74.5,73.9 v76.5,71.9 v78.5,69.9 v80.5,67.9 | v80.5,67.9 81.3,67.1 v81.3,66.7 81.4,66.7 v83.8,64.3 | v80.5,67.9 81.1,67.3 v82.7,67.3 85,65 v85,64.9 | v62.5,81.9 v64.5,79.9 v66.5,77.9 v68.5,75.9 v70.5,73.9 | v70.5,73.9 v72.5,71.9 v74.5,69.9 v76.5,67.9 v78.5,65.9 80.3,64.1 v81.1,64.1 82.55,62.65 v82.9,62.65 83.45,62.1 v85.05,62.1 | v60.5,79.9 v62.5,77.9 v64.5,75.9 v66.5,73.9 | v66.5,73.9 66.9,73.5 v66.9,73 v66.9,71.7 | v68.5,73 67.4,73 | 67.4,73 v66.5,73.9 | 67.4,73 68.5,71.9 v68.5,71.7 68.7,71.7 v70.5,69.9 v72.5,67.9 v74.5,65.9 | v70.5,73.9 70.6,73.8 v70.6,72.4 | v74.5,65.9 75.05,65.35 v75.05,64.25 | v77.95,64.25 76.5,64.25 | 76.5,64.25 76.15,64.25 v74.5,65.9 | v60.5,75.9 v60.5,79.9 | v60.5,75.9 v60.5,71.9 | v60.5,71.9 v60.5,67.9 | v60.5,67.9 v60.5,63.9 | v60.5,63.9 v60.5,59.9 v62.5,57.9 v64.5,55.9 | v60.5,63.9 v62.5,61.9 v64.5,59.9 | v64.5,59.9 v66.5,57.9 v68.5,55.9 | v60.5,67.9 v62.5,65.9 v64.5,63.9 66.5,61.9 v66.5,61.6 67.2,61.6 v69.8,59 70.5,58.3 v70.5,57.9 v72.5,55.9 | v64.5,59.9 64.8,60.2 v65.6,60.2
  Top 0.2: v60.5,71.9 v62.5,69.9 v64.5,67.9 v66.5,65.9 69.6,62.8 v69.6,62.25 69.8,62.05 v69.8,60.9 71.4,59.3 v72.3,59.3 73.1,59.3 v74.5,57.9 v76.5,55.9 | v60.5,75.9 v62.5,73.9 63.8,73.9 v64.9,72.8 v64.9,71.5 v66.5,69.9 v68.5,67.9 v70.5,65.9 71.85,64.55 v71.85,63.45 72.7,62.6 v72.7,62.45 73,62.45 v74.55,60.9 76.4,60.9 v77.25,60.05 v77.25,58.85 78.2,57.9 v78.5,57.9 v80.5,55.9 | 76.5,64.25 77.3,63.45 v77.3,62.05 | v76.1,62.05 v77.3,62.05 | v77.3,62.05 79.05,62.05 v79.45,62.45 v80.65,62.45 81.6,62.45 v82.9,61.15 | v79.15,60.7 79.75,60.7 v81.05,59.4 82.5,57.95 v82.5,57.9 v84.5,55.9 | v77.3,62.05 77.8,62.05 v79.15,60.7 | v79.15,60.7 79.15,59.5 v79.1,59.45
  Bottom 0.2: C5.2 76.35,26.15 79.3,23.2 | C2.2 80,22.5 79.3,23.2 | C5.2 76.15,26.15 75.4,25.4 75.4,24.6 74.7,23.9 U2.2 73.97,23.9 73.4,23.33 73.4,22.2 74,21.6 U1.6 | C5.2 76.05,26.15 75.3,26.9 C6.2 74.5,26.33 72.37,24.2 69.8,24.2 C4.2 67.25,24.15 63.25,20.15 v48.3,20.15 | RT3.1 88.01,4.65 RT4.1 88.18,4.68 88.9,5.4 88.9,23.9 | 88.9,23.9 88.9,42.6 87.3,44.2 87.3,54.9 86.15,56.05 H1.6 | 86.15,82.05 H1.1 H1.2 H1.3 H1.4 H1.5 83.78,57.75 R3.1 C15.2 80.1,58.9 U11.4 | H1.16 H1.17 H1.18 H1.19 H1.20 86.15,82.05 | H1.16 60.15,82.05 | 60.15,82.05 H1.15 | H1.6 H1.7 H1.8 73,56.05 R1.1 | H1.9 H1.10 60.15,56.05 H1.11 H1.12 | H1.12 H1.13 60.15,72.1 | 60.15,72.1 H1.14 | 86.15,82.05 87.2,83.1 87.2,90.35 | RT7.1 87.2,90.35 | RT6.1 57.1,85.1 60.15,82.05 | RT5.1 28.75,82.06 34.71,76.1 v35.3,76.1 | 60.15,72.1 58.2,72.1 57.1,73.2 57.1,75.8 v56.8,76.1 | 79.3,23.2 v80,23.9 | v82.6,23.9 88.9,23.9 | 87.2,90.35 58.35,90.35 56.4,92.3 13.6,92.3 12.45,91.15 RT8.1 | C24.C 13.75,78.15 C23.2 14.6,77.4 16.35,75.65 | R9.1 12.95,70.35 16.35,73.75 16.35,75.65 | 16.35,75.65 v19.95,75.65 | U10.2 66.57,57.9 65.2,57.9 64.9,58.2 64.9,63.05 | 64.9,63.05 64.9,63.4 C19.2 | C22.2 60.15,72.1 | H1.12 64.9,63.05 | C18.2 74.25,65.65 v74.5,65.9 | H1.6 84.8,55.9 v84.5,55.9 | H1.16 62.35,82.05 v62.5,81.9 | H1.12 60.15,63.55 v60.5,63.9
  pour Bottom: 86.3,82.2 86.3,55.9 60,55.9 60,82.2
  pour Top: 86.3,55.9 86.3,82.2 60,82.2 60,55.9
ATRIP
  Bottom 0.2: U10.1 68.27,58.83 70.1,57 70.1,55.9 68.5,54.3 R2.2
AVDD  (via drill 0.3)
  Top 0.2: v15.3,50.4 15.3,70.3 v13.5,72.1 13.55,72.1 14.55,73.1 TP1.1 | v15.3,43.1 15.3,24.8 22.8,17.3 51.7,17.3 v55.3,20.9 | v77.7,21.8 77.05,21.8 v73.08,25.77
  Bottom 0.2: U1.10 78.4,21.05 C2.1 78.5,21.25 77.95,21.8 v77.7,21.8 | C23.1 14.4,75.9 13.65,75.15 12.2,75.15 | 12.2,75.15 C24.A | 12.2,75.15 12.25,75.1 FB1.2 12.95,72.65 v13.5,72.1 | v15.3,50.4 v15.3,43.1 | v55.3,20.9 61.3,26.9 C6.1 | C6.1 73,25.85 v73.08,25.77 | C6.1 73,26.8 71.69,25.49 U2.5
AVREF-0  (via drill 0.3)
  Top 0.2: v67.5,21.7 TP3.1
  Bottom 0.2: 68.91,20.69 RN1.10 67.5,21.34 v67.5,21.7 | 68.91,20.69 69.9,19.7 69.9,17.91 69.7,17.71 69.7,17.01 71.1,15.61 RN1.5 | 68.91,20.69 69.75,21.53 C4.1 69.9,22.8 71.54,22.8 U2.4 72.05,22.95 73.95,24.85 U2.1
BALANCING-BOTTOM
  pour Bottom (rank 6, hatched): 2.5,0 89.9,0 arc90 90.4,0.5 90.4,42.9 arc90 89.4,43.9 arc-90 88.4,44.9 88.4,50.9 arc-90 89.4,51.9 arc90 90.4,52.9 90.4,95.3 arc90 89.9,95.8 10.5,95.8 arc90 10,95.3 10,84.5 arc-90 9.5,84 6,84 6,72.85 8.4,72.85 arc-180 8.4,70.95 6,70.95 6,32.75 10,32.75 arc-180 10,29.2 2.5,29.2 arc90 2,28.7 2,0.5 arc90
BALANCING-TOP
  pour Top (rank 6, hatched): 2.5,0 89.9,0 arc90 90.4,0.5 90.4,42.9 arc90 89.4,43.9 arc-90 88.4,44.9 88.4,50.9 arc-90 89.4,51.9 arc90 90.4,52.9 90.4,95.3 arc90 89.9,95.8 10.5,95.8 arc90 10,95.3 10,84.5 arc-90 9.5,84 6,84 6,72.85 8.4,72.85 arc-180 8.4,70.95 6,70.95 6,32.75 10,32.75 arc-180 10,29.2 2.5,29.2 arc90 2,28.7 2,0.5 arc90
BOOST_FB
  Bottom 0.2: R14.2 R13.1 21.4,88.9 | C30.2 24,89.65 22.15,89.65 21.4,88.9 | 21.4,88.9 22.56,87.74 22.56,87.07 22.14,86.65 U14.2
BOOST_FB-HIGH
  Bottom 0.2: R12.1 R13.2
BOOST_FB-LOW
  Bottom 0.2: R14.1 R15.2
BOOST_IN
  Bottom 0.2: L1.2 24.61,84.39 23.8,85.2 23.8,86.2 23.35,86.65 U14.5
BOOST_OUT
  Bottom 0.2: R12.2 C30.1 | U14.4 24.65,87.3 C26.1 C30.1 | C30.1 27.25,88.9 C29.A 27.94,89.21 U15.1 30.8,89.9 31,90.1 32.5,90.1 32.7,89.9 U15.3
BUS_I2C_SCL  (via drill 0.3)
  Top 0.2: v27.6,48.3 v26.8,47.5
  Top 0.6: J1.B31 v6,51.4
  Bottom 0.2: v6,51.4 16.19,51.4 19.89,47.7 26.61,47.7 v26.8,47.5 27,47.31 27,38.8 25.55,37.35 U5.2 | U13.2 25.66,65.35 27.4,63.61 27.4,48.49 v27.6,48.3 27.79,48.1 57.43,48.1 57.44,48.09 58.56,48.09 58.57,48.1 U7.3
  Bottom 0.6: J1.B31 v6,51.4
BUS_I2C_SDA  (via drill 0.3)
  Top 0.6: J1.B30 v6,52.4
  Bottom 0.2: v6,52.4 15.8,52.4 20.1,48.1 27,48.1 | U13.3 25.55,64.95 27,63.5 27,48.1 | U5.3 25.66,36.95 27.4,38.69 27.4,47.7 | 27,48.1 27.4,47.7 | U7.2 58.57,47.7 58.56,47.71 57.44,47.71 57.43,47.7 27.4,47.7
  Bottom 0.6: J1.B30 v6,52.4
CHASSIS  (via drill 0.3)
  Top 0.2: B2.CHASSIS@10 56.2,21.25 v56.2,3.6 56.2,2.8 55.2,1.8 J1.CHASSIS@3 | B2.CHASSIS@1 B1.CHASSIS@17 | B1.CHASSIS@3 56.2,74.55 v56.2,75 | v56.6,90.8 57.7,91.9 v57.7,92.3 57.7,93 56.7,94 J1.CHASSIS@2
  Bottom 0.2: B1.CHASSIS@1 B1.CHASSIS@3 | B1.CHASSIS@1 B1.CHASSIS@4 | B1.CHASSIS@1 B1.CHASSIS@5 | B1.CHASSIS@1 B1.CHASSIS@6 | B1.CHASSIS@1 B1.CHASSIS@7 | B1.CHASSIS@1 B1.CHASSIS@9 | B1.CHASSIS@1 B1.CHASSIS@2 | B2.CHASSIS@1 B2.CHASSIS@3 | B2.CHASSIS@1 B2.CHASSIS@4 | B2.CHASSIS@1 B2.CHASSIS@5 | B2.CHASSIS@1 B2.CHASSIS@6 | B2.CHASSIS@1 B2.CHASSIS@7 | B2.CHASSIS@1 B2.CHASSIS@8 B2.CHASSIS@13 B2.CHASSIS@10 | B2.CHASSIS@1 B2.CHASSIS@9 | B2.CHASSIS@1 B2.CHASSIS@2 | B2.CHASSIS@10 B2.CHASSIS@14 | B2.CHASSIS@10 B2.CHASSIS@15 | B2.CHASSIS@10 B2.CHASSIS@16 | B2.CHASSIS@10 B2.CHASSIS@17 | B2.CHASSIS@10 B2.CHASSIS@18 | B2.CHASSIS@10 B2.CHASSIS@11 | B2.CHASSIS@10 B2.CHASSIS@12 | v56.2,3.6 56.2,2.8 55.2,1.8 J1.CHASSIS@3 | v56.2,75 56.2,90.4 v56.6,90.8 | v57.7,92.3 57.7,93 56.7,94 J1.CHASSIS@2 | B1.CHASSIS@10 B1.CHASSIS@17 | B1.CHASSIS@10 B1.CHASSIS@16 | B1.CHASSIS@10 B1.CHASSIS@15 | B1.CHASSIS@10 B1.CHASSIS@14 | B1.CHASSIS@10 B1.CHASSIS@13 | B1.CHASSIS@10 B1.CHASSIS@12 | B1.CHASSIS@10 B1.CHASSIS@11 | B1.CHASSIS@10 B1.CHASSIS@18 | B1.CHASSIS@10 B1.CHASSIS@8 B1.CHASSIS@1
COUNT_1
  Bottom 0.2: U8.9 69.06,50 71.86,47.2 77.99,47.2 78.5,46.68 78.5,44.5 75.9,41.9 U6.8
COUNT_2
  Bottom 0.2: U6.1 72.25,43.35 70.33,45.27 U8.7
COUNT_3
  Bottom 0.2: U6.2 72.75,43.45 71.59,44.6 U8.6
COUNT_4
  Bottom 0.2: U6.3 73.25,43.55 72.86,43.94 U8.5
COUNT_5
  Bottom 0.2: U6.5 74.25,43.45 75.41,44.6 U8.3
COUNT_6
  Bottom 0.2: U6.6 74.75,43.35 76.67,45.27 U8.2
COUNT_7
  Bottom 0.2: U6.4 73.75,43.55 74.14,43.94 U8.4
COUNT_8
  Bottom 0.2: U8.13 74.14,50 75.86,48.28 78.44,48.28 79.58,47.13 79.58,43.58 75.91,39.9 U6.12
COUNT_9
  Bottom 0.2: U8.12 72.86,50 74.94,47.92 78.29,47.92 79.22,46.98 79.22,43.73 75.9,40.4 U6.11
COUNT_10
  Bottom 0.2: U8.14 75.41,50 76.77,48.64 78.58,48.64 79.94,47.28 79.94,43.43 75.77,39.25 U6.13
COUNT_11
  Bottom 0.2: U8.15 76.67,50 77.67,49 78.73,49 80.31,47.43 80.31,43.28 75.72,38.69 74.41,38.69 74.25,38.85 U6.14
COUNT_12
  Bottom 0.2: U6.7 75.4,42.7 77.94,45.24 U8.1
COUNTER_IN  (via drill 0.3)
  Top 0.2: v70.75,54.15 70.75,52.65 v70.6,52.5
  Bottom 0.2: U8.10 70.33,52.23 v70.6,52.5 | R1.2 v70.75,54.15 R2.1
COUNTER_RESET
  Bottom 0.2: U8.11 71.59,50 74.03,47.56 78.14,47.56 78.86,46.83 78.86,43.87 75.89,40.9 U6.10
DGND  (via drill 0.3)
  Top 0.2: v25,57.8 v25,60.7 v25,63.8 25,65.1 24.7,65.4 24.7,66.69 v24.59,66.8 | v25,29.8 v25,32.8 v25,35.8 25,37.1 24.7,37.4 24.7,38.7 v24.6,38.8 | v80.4,27.7 v80.4,30 | v60.2,51.4 60.9,51.4 v62.6,49.7 | v25.25,49.3 v25.25,46.5 | v25.25,49.3 v28.5,49.3 | v25.25,49.3 15.4,49.3 13.8,50.9 v13.8,67.9
  Bottom 0.2: R10.2 R9.2 12.85,68.85 v13.8,67.9 | v25,60.7 25,61.5 U12.4 | U9.4 25,58.5 v25,57.8 25.25,57.55 C14.2 v25.25,49.3 | v25,63.8 25,64.5 U13.4 | v24.6,38.8 24.4,38.8 23.75,39.45 C9.2 23.75,40.85 25.25,42.35 v25.25,46.5 | C7.2 25,28.9 v25,29.8 25,30.5 U3.4 | v25,32.8 25,33.5 U4.4 | v25,35.8 25,36.5 U5.4 | U1.PAD 75.5,19.65 U1.9 75.5,21.5 76.1,22.1 77.1,22.1 77.75,22.75 C3.2 78.3,22.9 79.25,21.95 79.25,20.25 80,19.5 | 80,19.5 C1.2 | U6.9 73.75,41.4 U6.PAD | U6.PAD 72.75,41.9 U6.23 U6.24 70.35,42.4 70.1,42.65 C10.2 69.85,42.65 67,45.5 C12.2 | U6.18 U6.17 U6.16 U6.15 | U6.15 73.75,40.9 U6.PAD | 80,19.5 80.56,20.06 80.56,27.54 v80.4,27.7 | v80.4,30 73.75,36.65 U6.15 | U8.8 69.06,46.64 68.05,47.65 C12.2 | C12.2 64.65,47.65 v62.6,49.7 | v28.5,49.3 29.15,48.65 56.6,48.65 | v60.2,51.4 59.5,51.4 | 59.5,51.4 58.7,51.4 56.6,49.3 56.6,48.65 | 59.5,51.4 C13.2 59.5,50.2 59.8,49.9 U7.4 59.1,48.5 58.95,48.65 C11.2 56.6,48.65 | v24.59,66.8 24.5,66.8 23.75,67.55 C21.2
DIFF_IN
  Bottom 0.2: R4.1 74.08,60.08 U11.6 76.47,60.08 76.7,60.3 76.7,62.3 75.75,63.25 R8.2
DIFF_INT_IN
  Bottom 0.2: C17.2 R8.1
DIFF_OUT
  Bottom 0.2: U11.7 75.58,60.72 75.39,60.91 75.34,60.91 74.61,61.65 R4.2 73.85,61.65 73.1,60.9 71.8,60.9 71.4,60.5 71.4,59.9 71.09,59.59 68.05,59.59 67.94,59.7 66.15,59.7 65.62,59.17 U10.3
I2C_SCL
  Bottom 0.2: U1.15 80.56,18.15 81.4,18.99 81.4,28.11 70,39.5 | U7.6 61.41,48.1 70,39.5 | U6.19 70.4,39.9 70,39.5
I2C_SCL-CAM0
  Bottom 0.2: U5.7 23.45,37.35 22,38.8 22,40.04 B2.8
I2C_SCL-CAM1
  Bottom 0.2: U13.7 23.45,65.35 22,66.8 22,68.04 B1.8
I2C_SDA  (via drill 0.3)
  Top 0.2: v70,40.3 v69.21,39.51
  Bottom 0.2: U1.14 80.55,18.65 81,19.1 81,28 69.49,39.51 v69.21,39.51 69.21,39.79 61.3,47.7 U7.7 | U6.20 70.1,40.4 v70,40.3
I2C_SDA-CAM0
  Bottom 0.2: B2.7 20.04,40.25 23.34,36.95 U5.6
I2C_SDA-CAM1
  Bottom 0.2: U13.6 23.34,64.95 20.04,68.25 B1.7
PD_IN
  Bottom 0.2: D1.C 69.45,72.35 R11.1 65.65,72.35 65.4,72.1 C22.1
PD_OUT_THRESH
  Bottom 0.2: R5.2 72.04,61.65 70.54,60.15 R6.1 66.65,60.15 65.62,61.18 U10.4
PD_VDIV_OUT
  Bottom 0.2: R3.2 C15.1 81.8,60.4 81.47,60.08 U11.3 78.38,60.08 77.72,59.42 U11.5 73.08,59.42 72.35,60.15 R5.1
PGND  (via drill 0.3)
  Top 0.2: v24.2,86.64 22.66,86.64 v22,87.3 | v12.35,63.65 12.35,67.55 v9.95,69.95 9.95,81.15 v10.8,82 | 6.3,53.5 6.2,53.6 6.2,54.4 J1.B28
  Top 0.6: v7.7,50.2 7.7,52.1 6.3,53.5
  Bottom 0.2: 19.4,87.4 C27.2 16.2,87.4 | R15.1 17.9,88.9 19.4,87.4 | 19.4,87.4 19.5,87.3 U14.3 v22,87.3 | C29.C 27.25,85.9 C26.2 24.75,86.09 v24.2,86.64 | C28.2 32.05,88.15 31.75,88.45 | U15.2 31.75,88.45 | C29.C 28.35,85.8 29.5,85.8 30.5,84.8 C25.2 TP5.1 | 31.75,88.45 31.45,88.15 30.25,88.15 28.5,86.4 C29.C | 16.2,87.4 TP7.1 | R10.1 10.35,70.35 v9.95,69.95 | v10.8,82 16.2,87.4
  Bottom 0.6: v6.2,61.4 10.1,61.4 v12.35,63.65 C20.2 18.77,63.65 B1.5 | B2.5 18.77,35.65 C8.2 15.15,35.65 7.7,43.1 v7.7,50.2
  other vias: 6.2,60.4 6.2,59.4
  pour Top: 6.5,61.7 5.5,61.7 5.5,53.1 6.5,53.1
  pour Bottom: 6.5,61.7 5.5,61.7 5.5,59.1 6.5,59.1
PR_3.3V-1  (via drill 0.3)
  Top 0.6: v6,82.4 J1.B2
  Bottom 0.6: J1.B2 v6,82.4
PR_3.3V-2  (via drill 0.3)
  Top 0.6: J1.A3 v6,81.4
  Bottom 0.6: v6,81.4 J1.A3
PR_3.3V-3  (via drill 0.3)
  Top 0.6: v6,80.4 J1.B4
  Bottom 0.6: J1.B4 v6,80.4
PR_3.3V-4  (via drill 0.3)
  Top 0.6: J1.A5 v6,79.4
  Bottom 0.6: v6,79.4 J1.A5
PR_3.3V-5  (via drill 0.3)
  Top 0.6: v6,78.4 J1.B6
  Bottom 0.6: J1.B6 v6,78.4
PR_3.3V-6  (via drill 0.3)
  Top 0.6: J1.A7 v6,77.4
  Bottom 0.6: v6,77.4 J1.A7
PR_3.3V-7  (via drill 0.3)
  Top 0.6: v6,76.4 J1.B8
  Bottom 0.6: J1.B8 v6,76.4
PR_3.3V-8  (via drill 0.3)
  Top 0.6: J1.A9 v6,75.4
  Bottom 0.6: v6,75.4 J1.A9
PR_3.3V-9  (via drill 0.3)
  Top 0.6: v6,74.4 J1.A10
  Bottom 0.6: J1.A10 v6,74.4
PR_BATT-0  (via drill 0.3)
  Top 0.6: v6,68.4 J1.B14
  Bottom 0.6: J1.B14 v6,68.4
PR_BATT-1  (via drill 0.3)
  Top 0.6: J1.A15 v6,67.4
  Bottom 0.6: v6,67.4 J1.A15
PR_BATT-2  (via drill 0.3)
  Top 0.6: v6,66.4 J1.A16
  Bottom 0.6: J1.A16 v6,66.4
PR_BATT-3  (via drill 0.3)
  Top 0.6: J1.B17 v6,65.4
  Bottom 0.6: v6,65.4 J1.B17
PR_BATT-4  (via drill 0.3)
  Top 0.6: v6,64.4 J1.B18
  Bottom 0.6: J1.B18 v6,64.4
PR_BATT-5  (via drill 0.3)
  Top 0.6: J1.B19 v6,63.4
  Bottom 0.6: v6,63.4 J1.B19
PR_BATT-6  (via drill 0.3)
  Top 0.6: v6,62.4 J1.B20
  Bottom 0.6: J1.B20 v6,62.4
QAMP_IN
  Bottom 0.2: U11.2 80.53,60.72 81.7,61.9 R7.1 C16.1 83.95,61.9 84.9,62.85 84.9,64.1 82,67 D1.A
QAMP_OUT
  Bottom 0.2: C16.2 R7.2 C17.1 80.25,63.25 80.05,63.05 80.05,61.42 U11.1
REG_FB
  Bottom 0.2: C28.1 34.69,86.59 U15.4
SPI_MISO  (via drill 0.3)
  Top 0.2: v6,44.4 10.3,44.4 10.8,44.9 v29.9,44.9 v31.1,44.9 | v29.9,46.1 29.9,58 v26.4,61.5
  Top 0.6: v6,44.4 J1.B38
  Bottom 0.2: v31.1,44.9 31.1,39.2 25.85,33.95 U4.3 | v29.9,44.9 v29.9,46.1 | v26.4,61.5 25.95,61.95 U12.3
  Bottom 0.6: J1.B38 v6,44.4
SPI_MISO-CAM0
  Bottom 0.2: B2.3 23.11,33.95 U4.6
SPI_MISO-CAM1
  Bottom 0.2: B1.3 23.11,61.95 U12.6
SPI_MOSI  (via drill 0.3)
  Top 0.2: v6,43.4 10.2,43.4 11.1,44.3 v29.3,44.3 v31.7,44.3 | v29.3,46.7 29.3,56.45 v26.4,59.35
  Top 0.6: J1.A39 v6,43.4
  Bottom 0.2: U3.2 25.65,31.35 31.7,37.4 v31.7,44.3 | v29.3,44.3 v29.3,46.7 | v26.4,59.35 U9.2
  Bottom 0.6: v6,43.4 J1.A39
SPI_MOSI-CAM0
  Bottom 0.2: B2.2 23.05,31.35 U3.7
SPI_MOSI-CAM1
  Bottom 0.2: B1.2 23.05,59.35 U9.7
SPI_SCK  (via drill 0.3)
  Top 0.2: v6,45.4 6.1,45.5 v30.5,45.5 30.5,58.25 v26.4,62.35
  Top 0.6: J1.B37 v6,45.4
  Bottom 0.2: U4.2 25.65,34.35 30.5,39.2 v30.5,45.5 | v26.4,62.35 U12.2
  Bottom 0.6: v6,45.4 J1.B37
SPI_SCK-CAM0
  Bottom 0.2: U4.7 20.97,34.35 B2.4
SPI_SCK-CAM1
  Bottom 0.2: U12.7 20.97,62.35 B1.4
TEMP_5V_REGULATOR  (via drill 0.3)
  Top 0.2: v58.86,70.9 58.86,25.04 v67,16.9
  Bottom 0.2: U1.19 74.5,16.91 72.49,14.9 70.2,14.9 68.22,16.88 | 68.22,16.88 RN1.7 | v67,16.9 68.2,16.9 68.22,16.88 | RT5.2 27.25,83.05 34.8,75.5 54.26,75.5 v58.86,70.9
TEMP_BOTTOM_LEFT  (via drill 0.3)
  Top 0.2: v68.7,14.65 68.74,14.69 68.74,19.63 69.07,19.96 v70.43,19.96
  Bottom 0.2: U1.4 71.58,19.65 RN1.2 70.81,19.96 v70.43,19.96 | RT3.2 60.2,6.15 v68.7,14.65
TEMP_BOTTOM_RIGHT  (via drill 0.3)
  Top 0.2: v77.1,17 72.6,21.5 v72.3,21.5
  Bottom 0.2: U1.5 71.95,20.15 71.41,20.69 | 71.41,20.69 RN1.1 | RT4.2 87.94,6.18 77.12,17 v77.1,17 | v72.3,21.5 71.49,20.69 71.41,20.69
TEMP_CAMERA-0  (via drill 0.3)
  Top 0.2: v72.4,17 71.3,18.1 v69.3,18.1 | v51.75,18.15 47.65,18.15 45.75,20.05 RT2.2
  Bottom 0.2: v72.4,17 73.2,17 73.45,17.25 U1.20 | v69.3,18.1 68.2,18.1 RN1.8 v51.75,18.15
TEMP_CAMERA-1  (via drill 0.3)
  Top 0.2: v72.9,17.6 71.1,19.4 v69.3,19.4 | RT1.2 56.35,75.65 59.5,72.5 59.5,26.9 v67,19.4
  Bottom 0.2: U1.1 73.1,17.8 v72.9,17.6 | v69.3,19.4 68.17,19.4 RN1.9 68.13,19.4 v67,19.4
TEMP_RADIATION_SENSOR  (via drill 0.3)
  Top 0.2: v58.3,72.8 58.3,24.3 v67,15.6
  Bottom 0.2: U1.18 75,16.9 72.64,14.54 70.05,14.54 68.98,15.61 RN1.6 v67.01,15.61 v67,15.6 | RT6.2 57,77.5 58.3,76.2 v58.3,72.8
TEMP_TOP_LEFT  (via drill 0.3)
  Top 0.2: v55.5,77.2 55.7,77 56.7,77 57.7,76 v57.7,75.4 | v57.7,73.5 57.7,23.6 67.21,14.09 70.79,14.09 v72.5,15.8
  Bottom 0.2: U1.2 72.55,18.65 72.2,18.3 72.2,17.6 71.48,16.88 | 71.48,16.88 RN1.4 | RT8.2 12.45,89.65 14.7,91.9 40.8,91.9 v55.5,77.2 | v57.7,75.4 v57.7,73.5 | v72.5,15.8 71.48,16.82 71.48,16.88
TEMP_TOP_RIGHT  (via drill 0.3)
  Top 0.2: v70.3,17.2 71.06,16.44 78.53,16.44 87.3,25.21 87.3,55.3 v87.6,55.6
  Bottom 0.2: U1.3 72.45,19.15 71.45,18.15 RN1.3 71.25,18.15 v70.3,17.2 | RT7.2 88,56 v87.6,55.6

### Text on the board
tPlace: GND | 3.3V | GND | 5V | AVDD | ADC REF | AVREF